# EAGLE design PoElli-at (EAGLE 6.5.0)
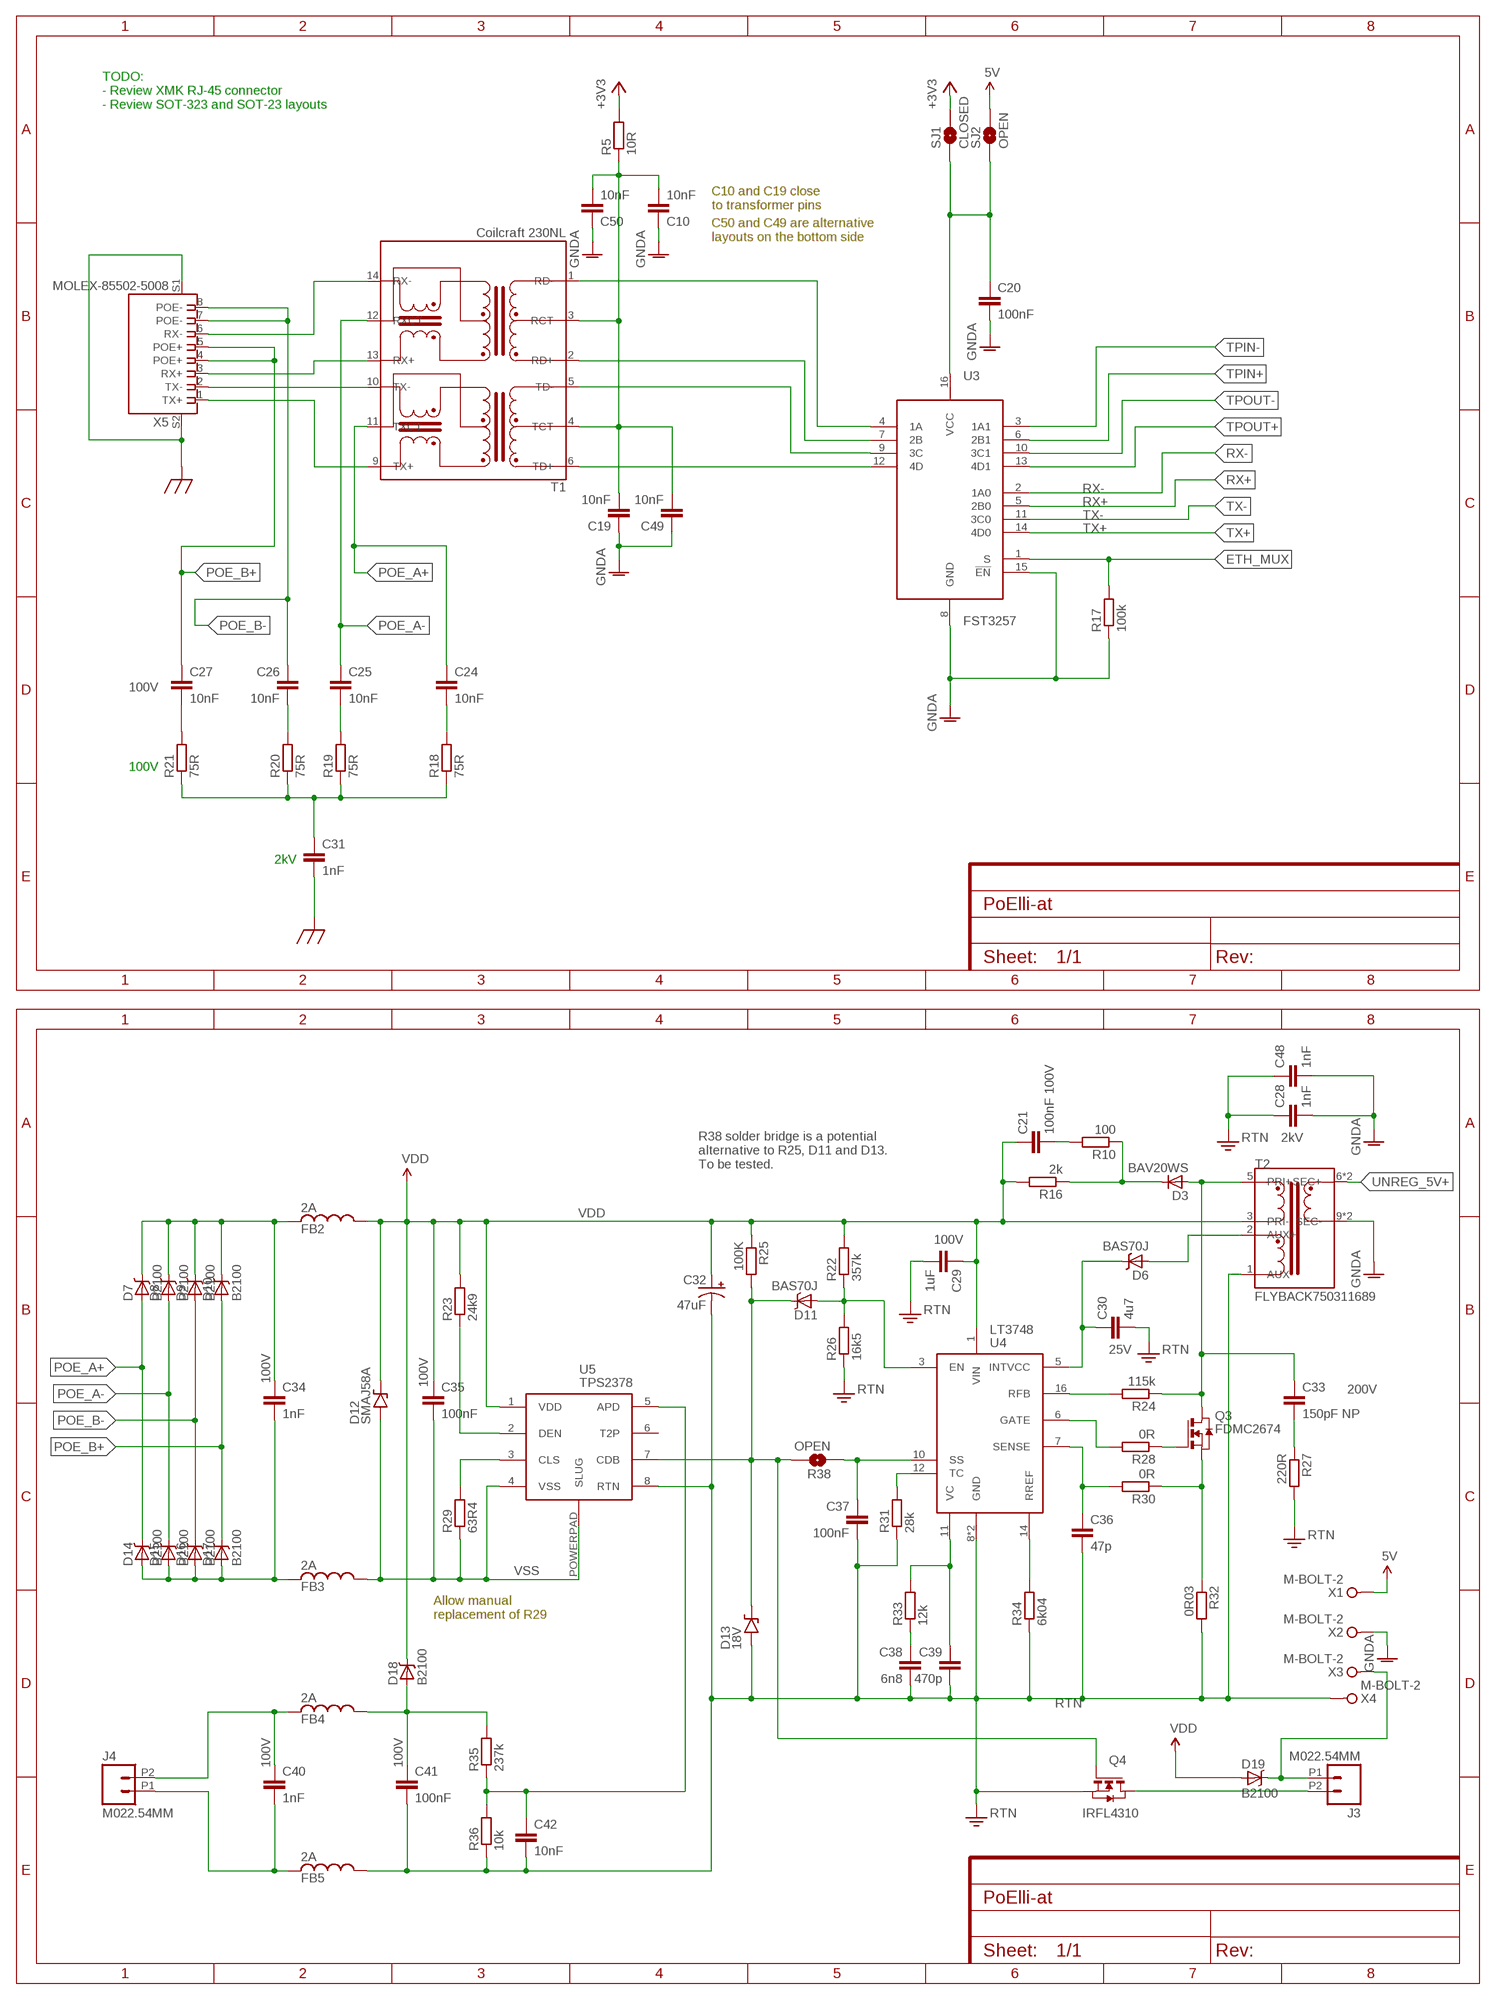
[diagram p0: schematic, sheet 1, part 1 of 2]
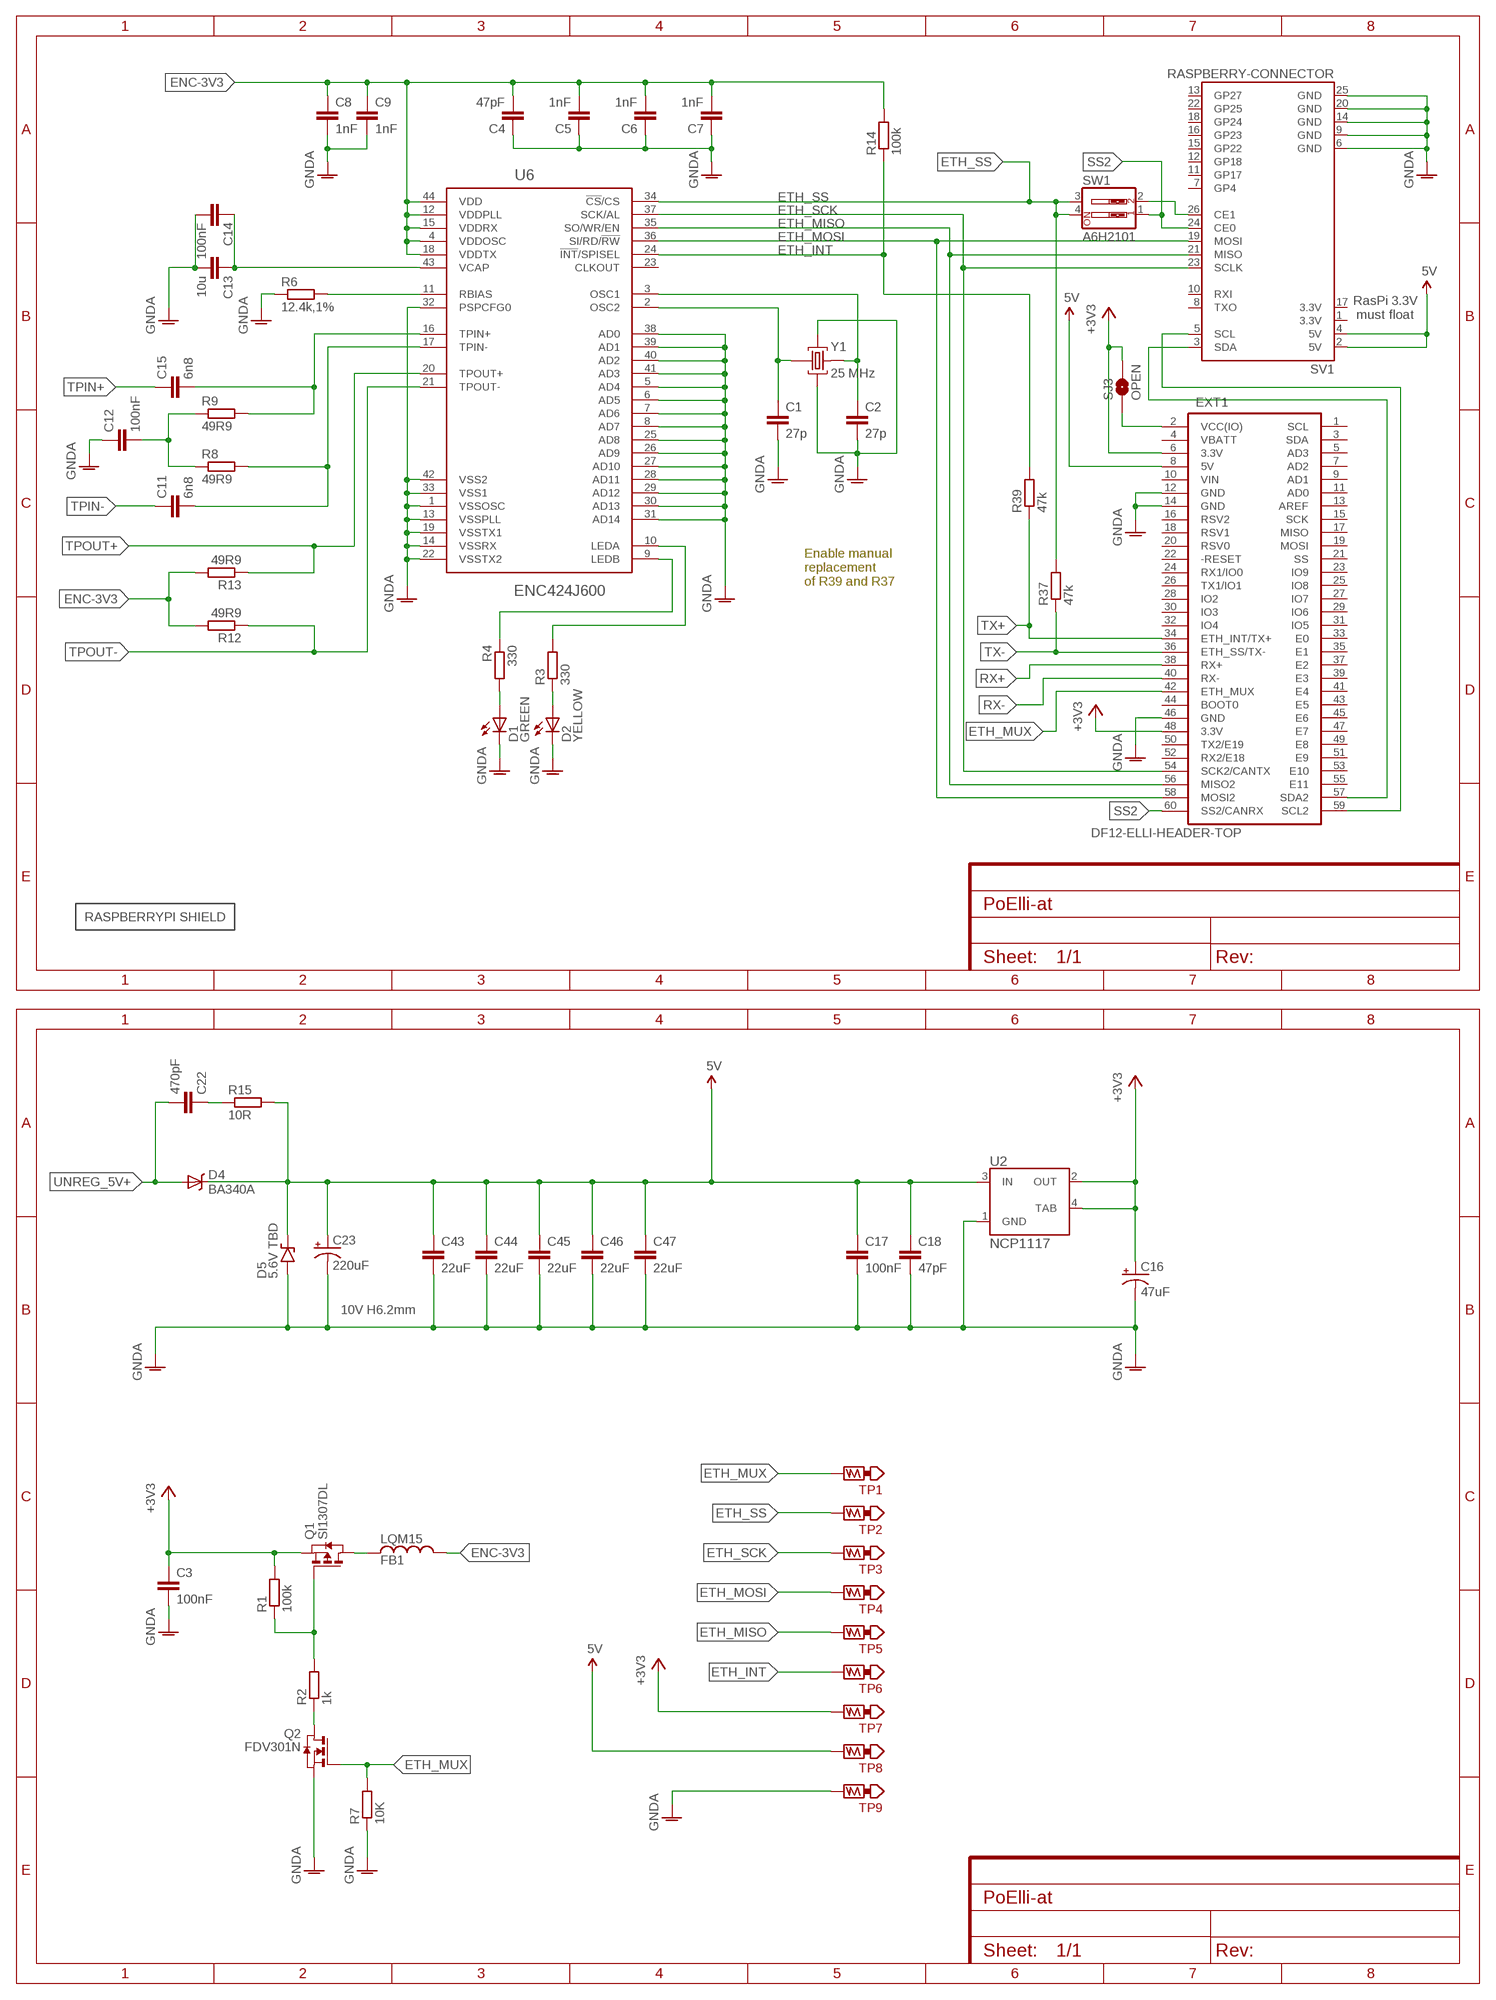
[diagram p1: schematic, sheet 1, part 2 of 2]

## Parts
C1  27p  C0402  [C0402]
C2  27p  C0402  [C0402]
C3  100nF  C0402  [C0402]
C4  47pF  C0402  [C0402]
C5  1nF  C0402  [C0402]
C6  1nF  C0402  [C0402]
C7  1nF  C0402  [C0402]
C8  1nF  C0402  [C0402]
C9  1nF  C0402  [C0402]
C10  10nF  C0402  [C0402]
C11  6n8  C0402  [C0402]
C12  100nF  C0402  [C0402]
C13  10u  C0603  [C0603]
C14  100nF  C0402  [C0402]
C15  6n8  C0402  [C0402]
C16  47uF  CPOL1206  [CT3216]
C17  100nF  C0402  [C0402]
C18  47pF  C0402  [C0402]
C19  10nF  C0402  [C0402]
C20  100nF  C0402  [C0402]
C21  100nF 100V  C0805  [C0805]
C22  470pF  C0603  [C0603]
C23  220uF  CPOLE  [CPOL_PANASONIC_E]
C24  10nF  C0603  [C0603]
C25  10nF  C0603  [C0603]
C26  10nF  C0603  [C0603]
C27  10nF  C0603  [C0603]
C28  1nF  CC1206  [C1206]
C29  1uF  C0805  [C0805]
C30  4u7  C0805  [C0805]
C31  1nF  C1210  [C1210]
C32  47uF  CPOL1206  [CT3216]
C33  150pF NP  C0805  [C0805]
C34  1nF  C0603  [C0603]
C35  100nF  C0805  [C0805]
C36  47p  C0402  [C0402]
C37  100nF  C0402  [C0402]
C38  6n8  C0402  [C0402]
C39  470p  C0402  [C0402]
C40  1nF  C0603  [C0603]
C41  100nF  C0805  [C0805]
C42  10nF  C0603  [C0603]
C43  22uF  C0805  [C0805]
C44  22uF  C0805  [C0805]
C45  22uF  C0805  [C0805]
C46  22uF  C0805  [C0805]
C47  22uF  C0805  [C0805]
C48  1nF  CC1206  [C1206]
C49  10nF  C0402  [C0402]
C50  10nF  C0402  [C0402]
D1  GREEN  LED-GREEN0603  [LED-0603]
D2  YELLOW  LED-YELLOW0603  [LED-0603]
D3  BAV20WS  [SOD-323]
D4  BA340A  B340A  [SMA-DIODE]
D5  5.6V TBD  DIODE-ZENER-SOD-123  [SOD-123FL]
D6  BAS70J  [SOD-323]
D7  B2100  DIODE-SCHOTTKYB2100  [DIODE-B2100]
D8  B2100  DIODE-SCHOTTKYB2100  [DIODE-B2100]
D9  B2100  DIODE-SCHOTTKYB2100  [DIODE-B2100]
D10  B2100  DIODE-SCHOTTKYB2100  [DIODE-B2100]
D11  BAS70J  [SOD-323]
D12  SMAJ58A  [SMA]
D13  18V  DIODE-ZENER-SOD-123  [SOD-123FL]
D14  B2100  DIODE-SCHOTTKYB2100  [DIODE-B2100]
D15  B2100  DIODE-SCHOTTKYB2100  [DIODE-B2100]
D16  B2100  DIODE-SCHOTTKYB2100  [DIODE-B2100]
D17  B2100  DIODE-SCHOTTKYB2100  [DIODE-B2100]
D18  B2100  DIODE-SCHOTTKYB2100  [DIODE-B2100]
D19  B2100  DIODE-SCHOTTKYB2100  [DIODE-B2100]
EXT1  DF12-ELLI-HEADER-TOP  [DF12(4.0)-60DP-0.5V]
FB1  LQM15  FB0402  [FB0402]
FB2  2A  FB1206  [FB1206]
FB3  2A  FB1206  [FB1206]
FB4  2A  FB1206  [FB1206]
FB5  2A  FB1206  [FB1206]
J3  M022.54MM  M022.54MM_SCREWTERM  [1X02_2.54_SCREWTERM]
J4  M022.54MM  M022.54MM_SCREWTERM  [1X02_2.54_SCREWTERM]
OUTLINE1  RASPBERRY-OUTLINE  [RASPBERRYPI-SHIELD-OUTLINE]
Q1  SI1307DL  [SOT-323]
Q2  FDV301N  [SOT-23]
Q3  FDMC2674  [MLP8L33]
Q4  IRFL4310  [SOT223]
R1  100k  R0402  [R0402]
R2  1k  R0402  [R0402]
R3  330  R0402  [R0402]
R4  330  R0402  [R0402]
R5  10R  R0603  [R0603]
R6  12.4k,1%  R0402  [R0402]
R7  10K  R0402  [R0402]
R8  49R9  R0402  [R0402]
R9  49R9  R0402  [R0402]
R10  100  R0603  [R0603]
R12  49R9  R0402  [R0402]
R13  49R9  R0402  [R0402]
R14  100k  R0402  [R0402]
R15  10R  R0603  [R0603]
R16  2k  R1206  [R1206]
R17  100k  R0402  [R0402]
R18  75R  R0603  [R0603]
R19  75R  R0603  [R0603]
R20  75R  R0603  [R0603]
R21  75R  R0603  [R0603]
R22  357k  R0603  [R0603]
R23  24k9  R0603  [R0603]
R24  115k  R0603  [R0603]
R25  100K  R0603  [R0603]
R26  16k5  R0603  [R0603]
R27  220R  R0805  [R0805]
R28  0R  R0603  [R0603]
R29  63R4  R0805  [R0805]
R30  0R  R0603  [R0603]
R31  28k  R0603  [R0603]
R32  0R03  R0805  [R0805]
R33  12k  R0603  [R0603]
R34  6k04  R0603  [R0603]
R35  237k  R0603  [R0603]
R36  10k  R0603  [R0603]
R37  47k  R0805  [R0805]
R38  OPEN  SOLDERJUMPERNO  [SJ_2S-NO]
R39  47k  R0805  [R0805]
SJ1  CLOSED  SOLDERJUMPERNC  [SJ_2S]
SJ2  OPEN  SOLDERJUMPERNO  [SJ_2S-NO]
SJ3  OPEN  SOLDERJUMPERNO  [SJ_2S-NO]
SV1  RASPBERRY-CONNECTOR  [RASPBERRYPI-SHIELD-CONNECTOR]
SW1  A6H2101  SW_DIP-2-SMT-HALFSIZE  [DIPSWITCH-02-50MIL]
T1  Coilcraft 230NL  POE-ISOLATION-230NL  [COILCRAFT-ETH1-230L]
T2  FLYBACK750311689  [WE_EP13_SMD_10PIN]
TP1  TEST_POINT-5000  [TP_5021]
TP2  TEST_POINT-5021  [TP_5000]
TP3  TEST_POINT-5021  [TP_5000]
TP4  TEST_POINT-5021  [TP_5000]
TP5  TEST_POINT-5000  [TP_5021]
TP6  TEST_POINT-5000  [TP_5021]
TP7  TEST_POINT-5000  [TP_5021]
TP8  TEST_POINT-5000  [TP_5021]
TP9  TEST_POINT-5000  [TP_5021]
U2  NCP1117  [SOT223]
U3  FST3257  [SOIC-16-NARROW]
U4  LT3748  [MSOP16(12)]
U5  TPS2378  [SO08-POWERPAD]
U6  ENC424J600  [TQFP44-0.8MM]
X1  M-BOLT-2  [M2-1]
X2  M-BOLT-2  [M2-1]
X3  M-BOLT-2  [M2-1]
X4  M-BOLT-2  [M2-1]
X5  MOLEX-85502-5008  POE-TP-SHIELDED-RJ45-MOLEX-85502-5008  [MOLEX-85502-5008]
Y1  25 MHz  CRYSTAL_WITH_GND  [CRYSTAL-SMD-3225-GND]

## Nets
5V [High current 3A (low voltage)]: C17.1 C18.1 C23.+ C43.1 C44.1 C45.1 C46.1 C47.1 D4.C D5.C EXT1.8(5V) R15.2 SJ2.2 SV1.2(5V) SV1.4(5V) TP8.P$1 U2.3(IN) X1.1(KL1)
+3V3 [High current 3A (low voltage)]: C3.1 C16.A(+) EXT1.6(3.3V) EXT1.48(3.3V) Q1.P$2(S) R1.2 R5.2 SJ1.2 SJ3.2 TP7.P$1 U2.2(OUT) U2.4(TAB)
ENC-3V3: C4.2 C5.2 C6.2 C7.2 C8.1 C9.1 FB1.2 R12.2 R13.2 R14.2 U6.4(VDDOSC) U6.12(VDDPLL) U6.15(VDDRX) U6.18(VDDTX) U6.44(VDD)
ETH_INT: R14.1 R39.2 TP6.P$1 U6.24(!INT!/SPISEL)
ETH_MISO: EXT1.56(MISO2) SV1.21(MISO) TP5.P$1 U6.35(SO/WR/EN)
ETH_MOSI: EXT1.58(MOSI2) SV1.19(MOSI) TP4.P$1 U6.36(SI/RD/!RW)
ETH_MUX: EXT1.42(ETH_MUX) Q2.P$1(G) R7.2 R17.2 TP1.P$1 U3.1(S)
ETH_SCK: EXT1.54(SCK2/CANTX) SV1.23(SCLK) TP3.P$1 U6.37(SCK/AL)
ETH_SS: R37.2 SW1.3 SW1.4 TP2.P$1 U6.34(!CS!/CS)
GNDA [High current 3A (low voltage)]: C1.2 C2.2 C3.2 C4.1 C5.1 C6.1 C7.1 C8.2 C9.2 C10.1 C12.1 C13.2 C14.2 C16.C(-) C17.2 C18.2 C19.1 C20.2 C23.- C28.2 C43.2 C44.2 C45.2 C46.2 C47.2 C48.2 C49.1 C50.1 D1.C D2.C D5.A EXT1.12(GND) EXT1.14(GND) EXT1.46(GND) Q2.P$2(S) R6.1 R7.1 R17.1 SV1.6(GND) SV1.9(GND) SV1.14(GND) SV1.20(GND) SV1.25(GND) T2.9(SEC-) T2.10(SEC-) TP9.P$1 U2.1(GND) U3.8(GND) U3.15(!EN) U6.1(VSSOSC) U6.5(AD4) U6.6(AD5) U6.7(AD6) U6.8(AD7) U6.13(VSSPLL) U6.14(VSSRX) U6.19(VSSTX1) U6.22(VSSTX2) U6.25(AD8) U6.26(AD9) U6.27(AD10) U6.28(AD11) U6.29(AD12) U6.30(AD13) U6.31(AD14) U6.32(PSPCFG0) U6.33(VSS1) U6.38(AD0) U6.39(AD1) U6.40(AD2) U6.41(AD3) U6.42(VSS2) X2.1(KL1) Y1.2(GND) Y1.4(GND)
N$1 [PoE 48V 1A]: T1.10(TX-) X5.2(TX-)
N$2 [PoE 48V 1A]: T1.9(TX+) X5.1(TX+)
N$3 [PoE 48V 1A]: T1.13(RX+) X5.3(RX+)
N$4 [PoE 48V 1A]: T1.14(RX-) X5.6(RX-)
N$5: C31.1 R18.1 R19.1 R20.1 R21.1
N$6 [PoE 48V 1A]: C34.1 D7.C D8.C D9.C D10.C FB2.1
N$7: R31.2 U4.12(TC)
N$8 [PoE 48V 1A]: C34.2 D14.A D15.A D16.A D17.A FB3.1
N$9: D11.2(C) D13.C Q4.1(G) R25.2 R38.2 U5.7(CDB)
N$10 [PoE 48V 1A]: J3.P2 Q4.2(D) Q4.4(D)
N$11: T1.6(TD+) U3.12(4D)
N$12: T1.5(TD-) U3.9(3C)
N$13: T1.2(RD+) U3.7(2B)
N$14: T1.1(RD-) U3.4(1A)
N$15: C33.2 R27.1
N$16: C22.1 R15.1
N$17: D11.1(A) R22.1 R26.2 U4.3(EN)
N$18: R23.1 U5.2(DEN)
N$19: R29.2 U5.3(CLS)
N$20: C37.1 R38.1 U4.10(SS)
N$21 [PoE 48V 1A]: D19.C J3.P1 X3.1(KL1)
N$22: C39.1 R33.2 U4.11(VC)
N$23: C38.1 R33.1
N$24: R28.2 U4.6(GATE)
N$25: Q3.4(G) R28.1
N$26: C36.1 R30.2 U4.7(SENSE)
N$27 [PoE 48V 1A]: Q3.1(S) Q3.2(S) Q3.3(S) R30.1 R32.1
N$28 [High voltage 200V and current 1A]: C33.1 D3.1(A) Q3.5(D) Q3.6(D) Q3.7(D) Q3.8(D) Q3.F1(D) R24.1 T2.5(PRI+)
N$29: D6.1(A) T2.2(AUX+)
N$31: R24.2 U4.16(RFB)
N$32: R34.2 U4.14(RREF)
N$33: D3.2(C) R10.1 R16.1
N$34: C21.2 R10.2
N$36: D1.A R4.2
N$37: C1.1 U6.2(OSC2) Y1.1(C1)
N$38: D2.A R3.1
N$39: C11.2 R8.2 U6.17(TPIN-)
N$40: C10.2 C19.2 C49.2 C50.2 R5.1 T1.3(RCT) T1.4(TCT)
N$41: R4.1 U6.9(LEDB)
N$42: R3.2 U6.10(LEDA)
N$44: C12.2 R8.1 R9.1
N$45: R6.2 U6.11(RBIAS)
N$47: C2.1 U6.3(OSC1) Y1.3(C2)
N$48: C27.2 R21.2
N$50: C24.2 R18.2
N$51: C25.2 R19.2
N$52: C26.2 R20.2
N$53 [PoE 48V 1A]: C40.1 FB4.1 J4.P2
N$54: C42.1 R35.1 R36.2 U5.5(APD)
N$55 [PoE 48V 1A]: C40.2 FB5.1 J4.P1
N$56: Q2.P$3(D) R2.1
N$57: Q1.P$1(G) R1.1 R2.2
N$59: C15.2 R9.2 U6.16(TPIN+)
N$60: FB1.1 Q1.P$3(D)
N$72: EXT1.57(SDA2) SV1.3(SDA)
N$73: EXT1.59(SCL2) SV1.5(SCL)
N$74: SV1.26(CE1) SW1.2
N$76: C41.1 D18.A FB4.2 R35.2
POE_A+ [PoE 48V 1A]: C24.1 D7.A D14.C T1.11(TXCT)
POE_A- [PoE 48V 1A]: C25.1 D8.A D15.C T1.12(RXCT)
POE_B+ [PoE 48V 1A]: C27.1 D10.A D17.C X5.4(POE+) X5.5(POE+)
POE_B- [PoE 48V 1A]: C26.1 D9.A D16.C X5.7(POE-) X5.8(POE-)
RTN [PoE 48V 1A]: C28.1 C29.2 C30.2 C32.C(-) C36.2 C37.2 C38.2 C39.2 C41.2 C42.2 C48.1 D13.A FB5.2 Q4.3(S) R26.1 R27.2 R31.1 R32.2 R34.1 R36.1 T2.1(AUX-) U4.8(GND) U4.9(GND) U5.8(RTN) X4.1(KL1)
RX+: EXT1.38(RX+) U3.5(2B0)
RX-: EXT1.40(RX-) U3.2(1A0)
SGND: C31.2 X5.S1(GND) X5.S2(GND)
SS2: EXT1.60(SS2/CANRX) SV1.24(CE0) SW1.1
TPIN+: C15.1 U3.6(2B1)
TPIN-: C11.1 U3.3(1A1)
TPOUT+: R13.1 U3.13(4D1) U6.20(TPOUT+)
TPOUT-: R12.1 U3.10(3C1) U6.21(TPOUT-)
TX+: EXT1.34(ETH_INT/TX+) R39.1 U3.14(4D0)
TX-: EXT1.36(ETH_SS/TX-) R37.1 U3.11(3C0)
U3_VCC: C20.1 SJ1.1 SJ2.1 U3.16(VCC)
U4_INTVCC: C30.1 D6.2(C) U4.5(INTVCC)
UNREG_5V+ [High current 3A (low voltage)]: C22.2 D4.A T2.6(SEC+) T2.7(SEC+)
VCAP: C13.1 C14.1 U6.43(VCAP)
VCC(IO): EXT1.2(VCC(IO)) SJ3.1
VDD [PoE 48V 1A]: C21.1 C29.1 C32.A(+) C35.1 D12.1(C) D18.C D19.A FB2.2 R16.2 R22.2 R23.2 R25.1 T2.3(PRI-) U4.1(VIN) U5.1(VDD)
VSS [PoE 48V 1A]: C35.2 D12.2(A) FB3.2 R29.1 U5.4(VSS) U5.POWERPAD(SLUG)
Unconnected: EXT1.1(SCL) EXT1.3(SDA) EXT1.5(AD3) EXT1.7(AD2) EXT1.9(AD1) EXT1.11(AD0) EXT1.13(AREF) EXT1.15(SCK) EXT1.16(RSV2) EXT1.17(MISO) EXT1.18(RSV1) EXT1.19(MOSI) EXT1.20(RSV0) EXT1.21(SS) EXT1.22(-RESET) EXT1.23(IO9) EXT1.24(RX1/IO0) EXT1.25(IO8) EXT1.26(TX1/IO1) EXT1.27(IO7) EXT1.28(IO2) EXT1.29(IO6) EXT1.30(IO3) EXT1.31(IO5) EXT1.32(IO4) EXT1.33(E0) EXT1.35(E1) EXT1.37(E2) EXT1.39(E3) EXT1.41(E4) EXT1.43(E5) EXT1.44(BOOT0) EXT1.45(E6) EXT1.47(E7) EXT1.49(E8) EXT1.50(TX2/E19) EXT1.51(E9) EXT1.52(RX2/E18) EXT1.53(E10) EXT1.55(E11) SV1.7(GP4) SV1.8(TXO) SV1.10(RXI) SV1.11(GP17) SV1.12(GP18) SV1.13(GP27) SV1.15(GP22) SV1.16(GP23) SV1.18(GP24) SV1.22(GP25) U5.6(T2P) U6.23(CLKOUT)

## Notes on the sheet
- TODO:
  - Review XMK RJ-45 connector
  - Review SOT-323 and SOT-23 layouts
- C10 and C19 close 
  to transformer pins
- C50 and C49 are alternative
  layouts on the bottom side
- RasPi 3.3V 
  must float
- Enable manual 
  replacement
  of R39 and R37
- 100V
- 100V
- 2kV
- 2kV
- R38 solder bridge is a potential
  alternative to R25, D11 and D13.
  To be tested.
- 100V
- 10V H6.2mm
- 25V
- 100V
- 100V
- 200V
- Allow manual 
  replacement of R29
- 100V | 100V

## Power pins joined to a net without a drawn wire
3.3V: SV1.1(3.3V) SV1.17(3.3V)
VBATT: EXT1.4(VBATT)
VIN: EXT1.10(VIN)

## Library data of the parts
C1-C15 C17-C22 C24-C31 C33-C50 = ELL-i-Passives:C: Surface Mount Capasitors — in standard sizes A capacitor used to store energy electrostatically in an electric field. If you need a high-value capacitor, consider using a polarised capacitor to save space. Wikipedia article on capacitors <https://en.wikipedia.org/wiki/Capacitor>
C16 C23 C32 = ELL-i-Passives:CPOL: Polarized Capacitor — common SMD and some through-hole ones A capacitor used to store energy electrostatically in an electric field. If you need a high-value capacitor, consider using a polarised capacitor to save space. Wikipedia article on capacitors <https://en.wikipedia.org/wiki/Capacitor> These are standard surface mount (SMD) and through-hole (PTH) capacitors. Normally 10uF, 47uF, and 100uF in electrolytic and tantalum varieties. Always verify the external diameter of the through hole cap, it varies with capacity, voltage, and manufacturer. The EIA tantalum devices should have standard packages. Copied from SparkFun-Passives.lbr under SparkFun Creative Commons license. Adopted to EagleUp usage through renaming the packages appropriately.
D1 = SparkFun-LED:LED-GREEN: Various green LEDs Green LEDs used in SFE Production 0603- DIO-00821 LARGE- DIO-00862 LILYPAD- DIO-09910; PROD_ID: DIO-00821
D2 = SparkFun-LED:LED-YELLOW: Yellow SMD LEDs LilyPad 1206- DIO-09909 0603- DIO-09003; PROD_ID: DIO-09003
D3 = ELL-i-DIscreteSemi:BAV20WS: Small Signal Switching Diodes, High Voltage Diodes datasheet <http://www.diodes.com/datasheets/ds30119.pdf> Vishay datasheet <http://www.vishay.com/docs/85726/bav19ws.pdf>
D4 = SparkFun-DiscreteSemi:B340A: Schottky Diode 3A-40V; PROD_ID: DIO-09886
D5 D13 = ELL-i-DIscreteSemi:DIODE-ZENER
D6 D11 = ELL-i-DIscreteSemi:BAS70: Silicon Schottky Diodes General-purpose diode for high-speed switching. Maximum forward current 70 mA Maxiumum forward voltage drop Vf 0.410 mV Maximum reverse voltage 70V
D7-D10 D14-D19 = ELL-i-DIscreteSemi:DIODE-SCHOTTKY: Schottky Diodes A Schottky diode has a low forward voltage drop and a very fast switching action. A normal silicon diode has a voltage drop between 0.6–0.7 volts, while a Schottky diode voltage drop is between approximately 0.15–0.45 volts. This lower voltage drop can provide higher switching speed and better system efficiency. Wikipedia article on Schottky diodes <https://en.wikipedia.org/wiki/Schottky_diode>
D12 = ELL-i-DIscreteSemi:SMAJ58A
EXT1 = ELL-i-Connectors:DF12-ELLI-*
FB1-FB5 = ELL-i-Passives:FB: Ferrite beads Ferrite beads are choke coils used to suppress high frequency noise in electronic circuits. Wikipedia article on ferrite beads <https://en.wikipedia.org/wiki/Ferrite_bead>
J3 J4 = SparkFun-Connectors:M02: Standard 2-pin 0.1" header. Use with - straight break away headers ( PRT-00116) - right angle break away headers (PRT-00553) - swiss pins (PRT-00743) - machine pins (PRT-00117) - female headers (PRT-00115) Molex polarized connector foot print use with: PRT-08233 with associated crimp pins and housings. 2.54_SCREWTERM for use with PRT-10571. 3.5mm Screw Terminal footprints for PRT-08084 5mm Screw Terminal footprints for use with PRT-08433
OUTLINE1 = ELL-i-Boards:RASPBERRY-OUTLINE
Q1 = ELL-i-DIscreteSemi:SI1307DL
Q2 = ELL-i-DIscreteSemi:FDV301N: Digital FET, N-Channel This device has been designed especially for low voltage applications as a replacement for digital transistors. 25 V, 0.22 A continuous. 0.5 A peak Rds(on) < 5R @ Vgs 2.7 V. Datasheet <http://datasheet.octopart.com/FDV301N-Fairchild-datasheet-8330556.pdf>
Q3 = ELL-i-DIscreteSemi:FDMC2674: 220V N-Channel UltraFET Trench MOSFET This is a power MOSFET, capable of passing 2A of current and lasting some 200V, in a small MLP package. For a typical flyback converter, you need the switching FET to last much higher voltage than the nominal primary side voltage, as the flyback generates a high parasitic voltage at the time the FET switches off, before the so-called snubber circuit is able to absorb it. Datasheet <http://www.fairchildsemi.com/ds/FD/FDMC2674.pdf‎>
Q4 = ELL-i-DIscreteSemi:IRFL4310
R1-R10 R12-R37 R39 = ELL-i-Passives:R: Surface Mount Resistor — in standard sizes
R38 SJ1-SJ3 = SparkFun-Passives:SOLDERJUMPER: Solder Jumper Standard SMD solder jumper. Used to automate production. Two varients : Normally Open and Normally Closed are the same, but have different paste layers. NC will have a large amount of paste and should jumper during reflow.
SV1 = ELL-i-Boards:RASPBERRY-CONNECTOR
SW1 = SparkFun-Electromechanical:SW_DIP-2: DIP SWITCH
T1 = ELL-i-Transformers:POE-ISOLATION: Power-over-Ethernet isolation transformers In twisted pair Ethernet networks, there is a 1500V isolation transformer between the network cable and the connected device. In Power-over-Ethernet devices, the transformer provides the extra function of allowing the DC power to be extracted from the cable-side center taps of the transformer. For high-power PoE, the transformer cable-side winding must be of thick enough wire (i.e. have low-enough resistance) to carry the DC current without warming up too much. Isolation transformers <https://en.wikipedia.org/wiki/Isolation_transformer> (general article) Power-over-Ethernet <https://en.wikipedia.org/wiki/Power_over_Ethernet> (general article)
T2 = ELL-i-Transformers:FLYBACK: Flyback SMPS transformer These types of transformers are often used in flyback and forward SMPS converters. The primary-side auxillary winding typically used to generate a 7-12 V auxillary voltage, which is used to generate the operating voltage (VCC) for the SMPS controller chip. The packages includes the ones used at various ELL-i boards.
TP1-TP9 = ELL-i-Passives:TEST_POINT: Used for easier attachment of measuring equipment. Has both test loops and bare copper area.
U2 = ELL-i-PowerIC:NCP1117
U3 = ELL-i-DigitalIC:FST3257: Quad 2:1 Multiplexer / Demultiplexer Bus Switch
U4 = ELL-i-PowerIC:LT3748: 100V Isolated Flyback Controller A switching regulator controller designed for the isolated flyback topology. Drives an external N-channel power MOSFET from an internally regulated 7V supply. No third winding or opto-isolator are required. Product page <http://www.linear.com/product/LT3748> Datasheet <http://www.linear.com/docs/29653> Wiki page <https://github.com/Ell-i/ELL-i-Eagle-Libraries/wiki/PowerIC-LT3748>
U5 = ELL-i-PowerIC:TPS2378: TI 802.3at Power-over-Ethernet controller with an integrated FET This IC contains all of the features needed to implement an IEEE802.3at type-2 powered device (PD). It includes an 0.5 Ω RDSON Power FET, which enables continuous 0.85 A current. It supports also auxiliary power. Product page <http://www.ti.com/product/tps2378> Datasheet <http://www.ti.com/lit/gpn/tps2378> Wiki page <https://github.com/Ell-i/ELL-i-Eagle-Libraries/wiki/PowerIC-TPS2378>
U6 = ELL-i-DigitalIC:ENC424J600: ENC424J600 The ENC424J600 and ENC624J600 are stand-alone, Fast Ethernet controllers with an industry standard Serial Peripheral Interface (SPI) or a flexible parallel interface. They are designed to serve as an Ethernet network interface for any microcontroller equipped with SPI or a standard parallel port Not reviewed. Datasheet <http://ww1.microchip.com/downloads/en/DeviceDoc/39935b.pdf>
X1-X4 = ELL-i-Connectors:M-BOLT: Metric bolt connector
X5 = ELL-i-Connectors:POE-TP-SHIELDED: Twisted pair Power-over-Ethernet MDI connector, with protective ground 8-wire Ethernet jack, with a protective ground. See the POE-TP device for more information.
Y1 = SparkFun-FreqCtrl:CRYSTAL_WITH_GND: Crystals with ground connection to case. A ground connection is used for mechanical stability and to minimize noise. Be careful to not overheat the body of crystal while soldering.

## Net classes
1 PoE 48V 1A: width 0.4 mm
2 High current 3A (low voltage): width 0.8 mm
3 High voltage 200V and current 1A: width 0.8 mm, clearance 0.5 mm

## Board
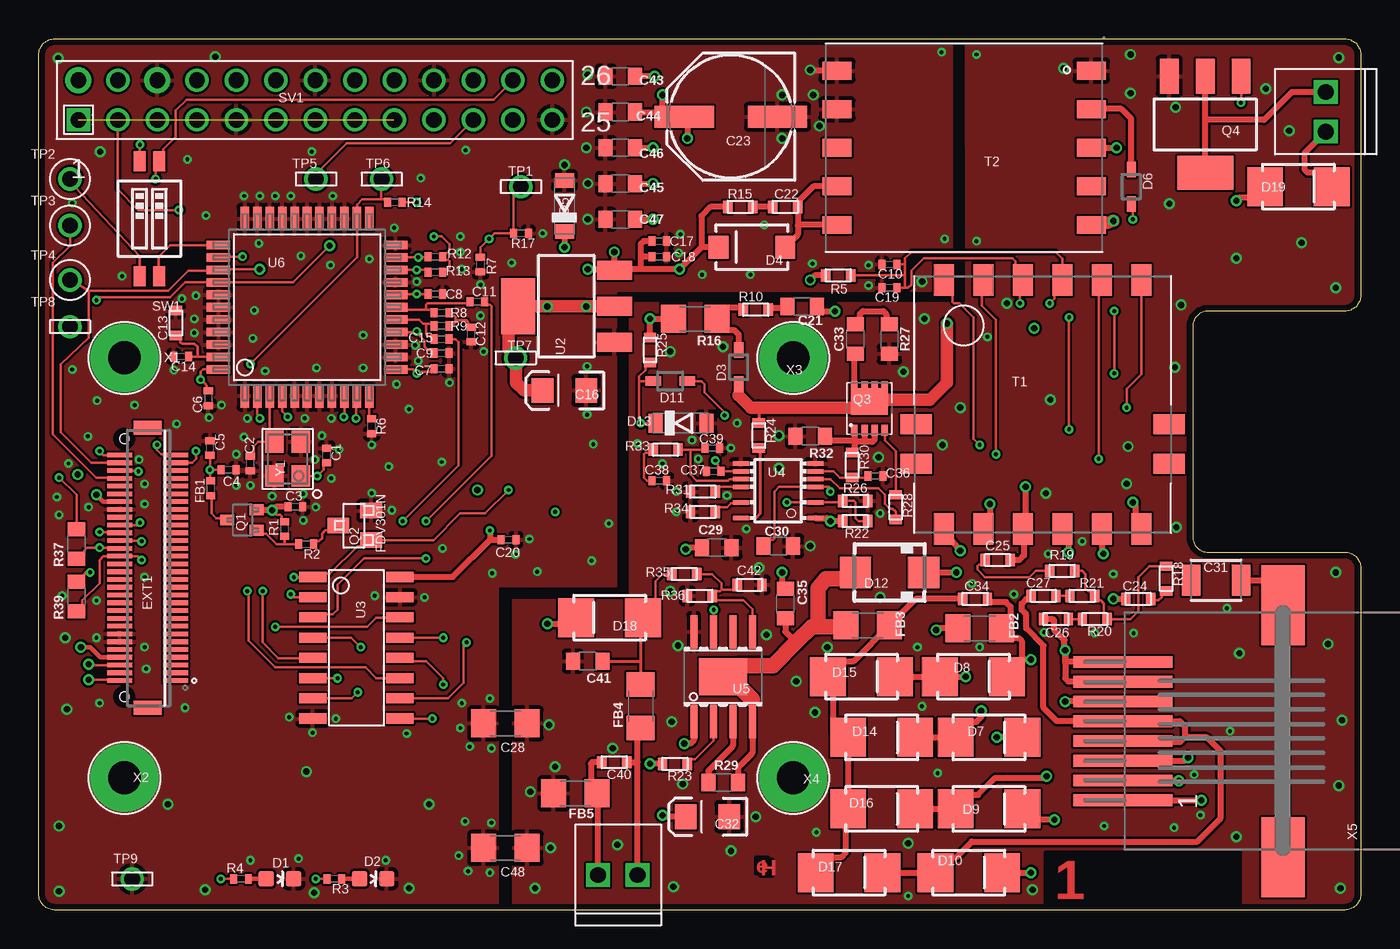
[diagram p2: board, top side]
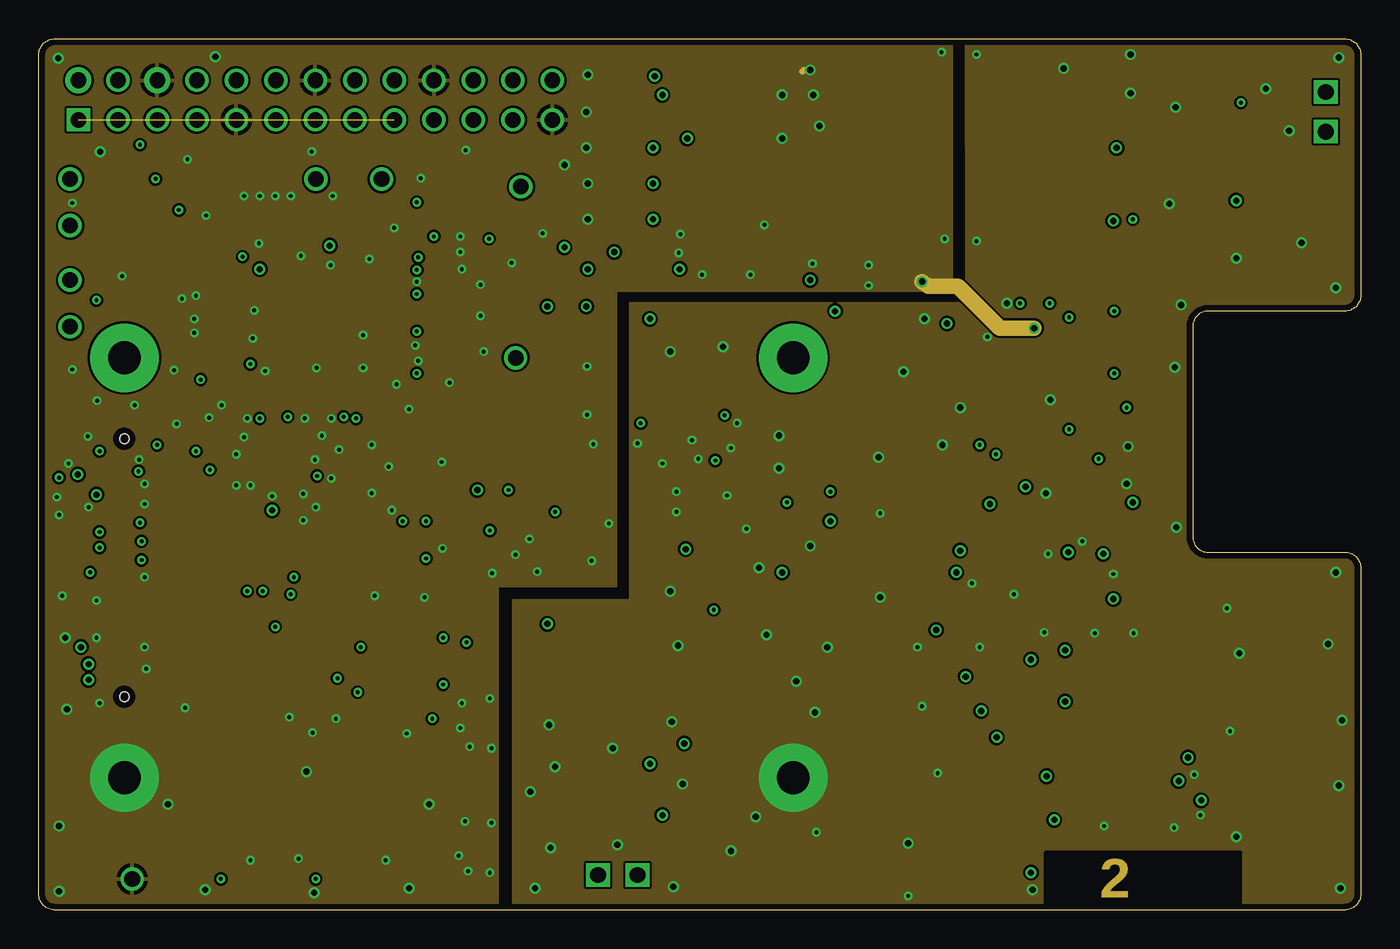
[diagram p3: board, inner layer Route2]
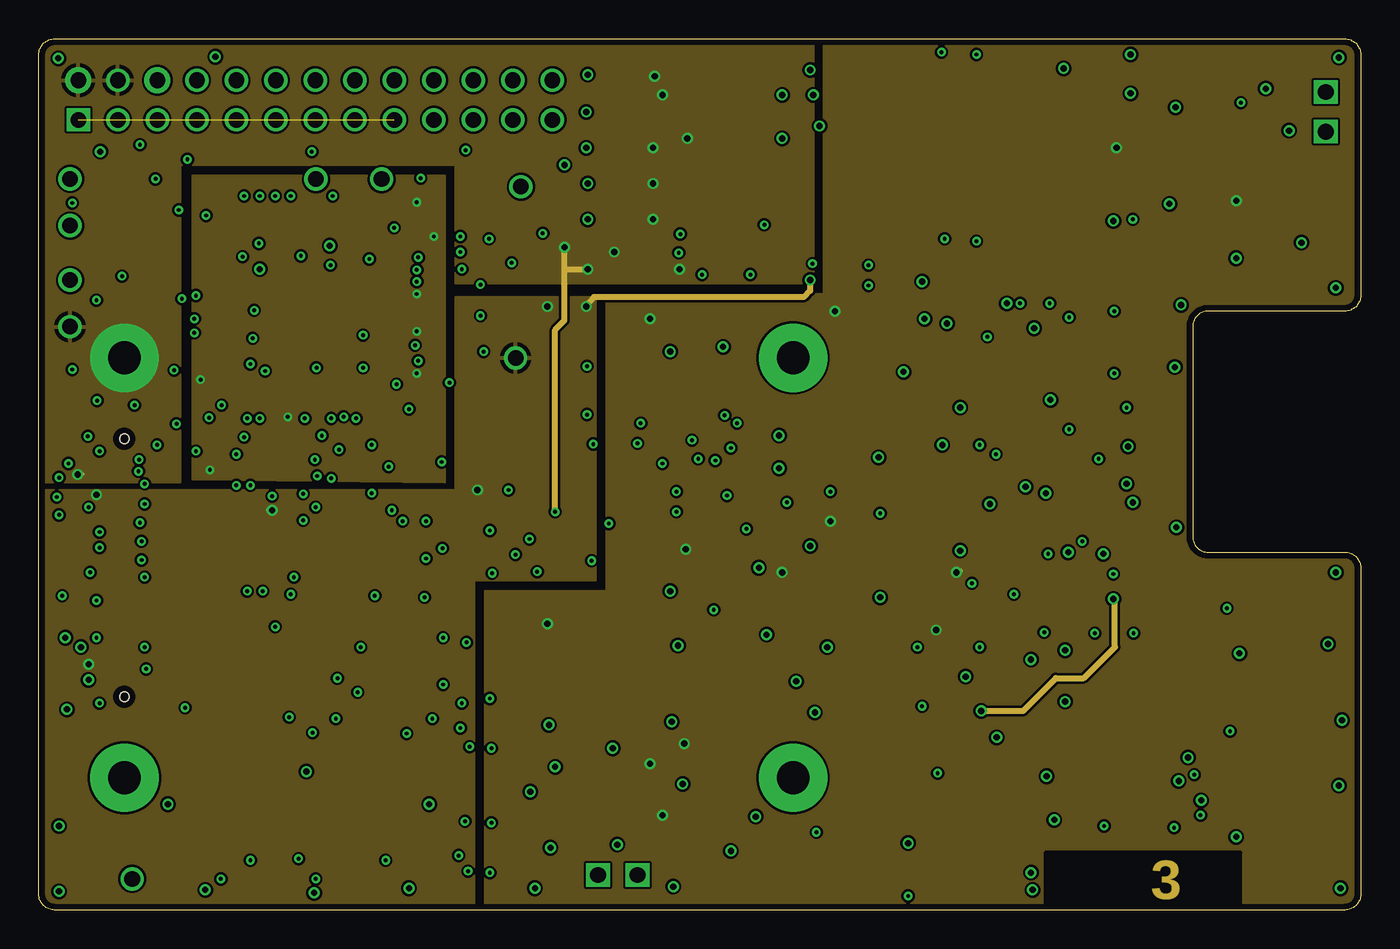
[diagram p4: board, inner layer Route15]
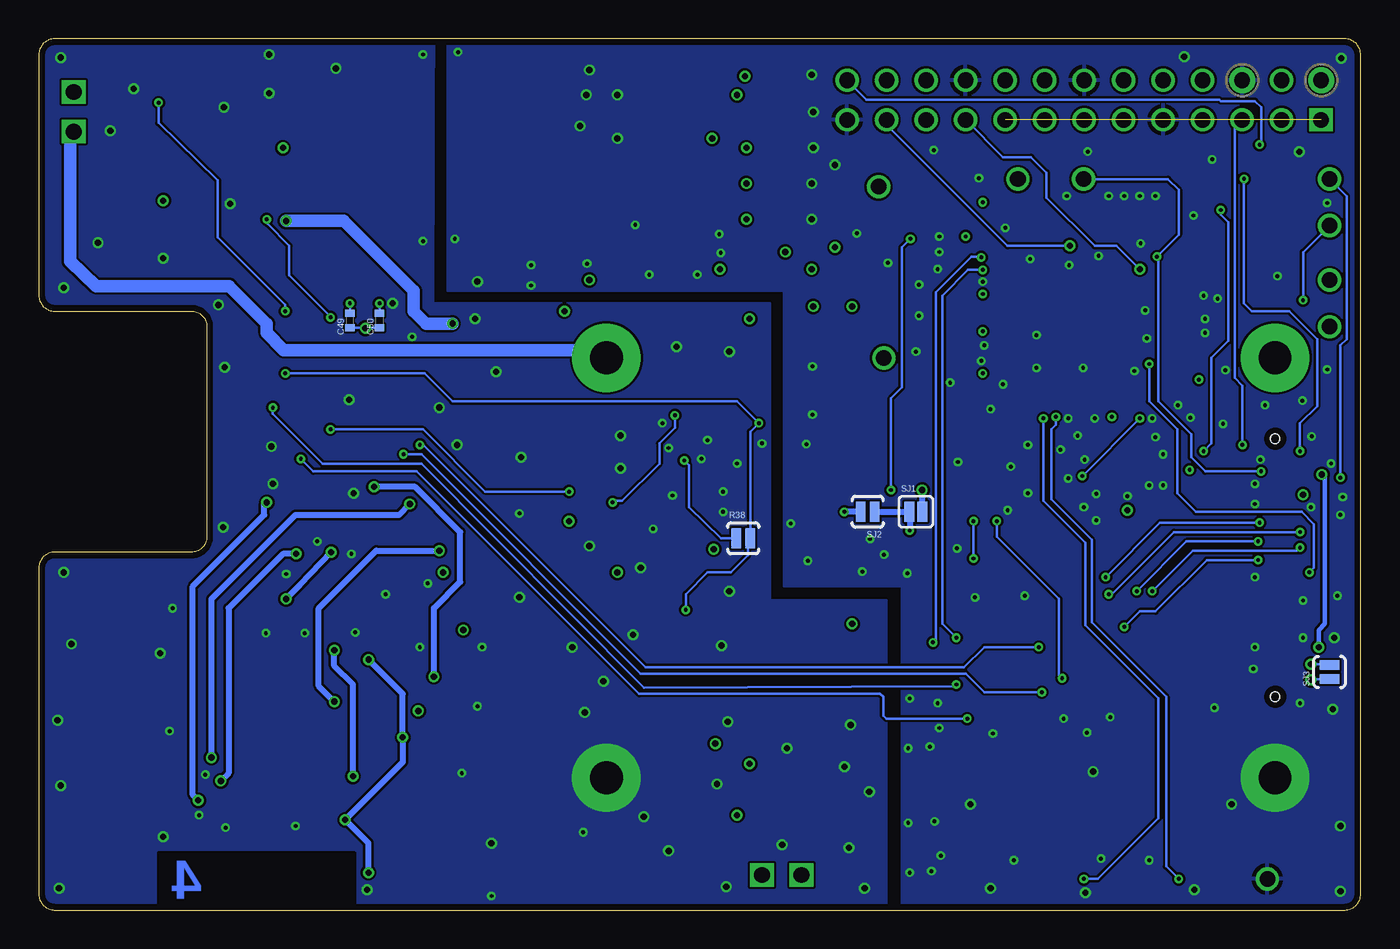
[diagram p5: board, bottom side, seen from below]

Size 85 x 56 mm. Coordinates in mm from the lower left corner, seen from the top.
Outline: 84,0 1,0 arc-90 0,1 0,55 arc-90 1,56 84,56 arc-90 85,55 85,39.5 arc-90 84,38.5 75.2,38.5 arc90 74.2,37.5 74.2,24 arc90 75.2,23 84,23 arc-90 85,22 85,1 arc-90 84,0
Copper layers (1*2+15*16): Top 0.035mm / dielectric 1.5mm / Route2 0.035mm / dielectric 0.15mm / Route15 0.035mm / dielectric 0.2mm / Bottom 0.035mm
Design rules "default *": minimum track width 0.15mm, minimum drill 0.25mm, track to track 0.15mm, track to pad 0.15mm, pad to pad 0.15mm, via to via 0.15mm, smd to smd 0mil, copper to edge 16mil, drill to drill 8mil, minimum pad ring 0.15mm, minimum via ring 0.15mm, stop-mask expansion 4mil, vias tented up to drill 0.0104125mm, thermal gap 10mil

### Footprints (pad centres in the part's own frame; a part is rotated, then mirrored left to right if it is on the bottom)
C0402 = smd 0.45 x 0.6: 1 -0.475,0; 2 0.475,0
C0603 = smd 0.6 x 0.8: 1 -0.8,0; 2 0.8,0
CT3216 = smd 1.4 x 1.6: A 1.4,0; C -1.4,0
C0805 = smd 0.9 x 1.1: 1 -0.95,0; 2 0.95,0
CPOL_PANASONIC_E = smd 3.8 x 1.4: + 3,0; - -3,0
C1206 = smd 1.6 x 1.8: 1 -1.4,0; 2 1.4,0
C1210 = smd 1.2 x 2: 1 -1.6,0; 2 1.6,0
LED-0603 = smd 1 x 1: A 0,-0.877; C 0,0.877
SOD-323 = smd 1 x 0.6: 1 -1.1,0; 2 1.1,0
SMA-DIODE = smd 1.27 x 1.47: A -2.15,0; C 2.15,0
SOD-123FL = smd 0.914 x 1.219: A 1.638,0; C -1.638,0
DIODE-B2100 = smd 2.3 x 2.5: A -2.15,0; C 2.15,0
SMA = smd 2 x 2: 1 -2.2,0; 2 2.2,0
DF12(4.0)-60DP-0.5V = smd 0.3 x 1.6: 1 -7.25,-1.8; 2 -7.25,1.8; 3 -6.75,-1.8; 4 -6.75,1.8; 5 -6.25,-1.8; 6 -6.25,1.8; 7 -5.75,-1.8; 8 -5.75,1.8; 9 -5.25,-1.8; 10 -5.25,1.8; 11 -4.75,-1.8; 12 -4.75,1.8; 13 -4.25,-1.8; 14 -4.25,1.8; 15 -3.75,-1.8; 16 -3.75,1.8; 17 -3.25,-1.8; 18 -3.25,1.8; 19 -2.75,-1.8; 20 -2.75,1.8; 21 -2.25,-1.8; 22 -2.25,1.8; 23 -1.75,-1.8; 24 -1.75,1.8; 25 -1.25,-1.8; 26 -1.25,1.8; 27 -0.75,-1.8; 28 -0.75,1.8; 29 -0.25,-1.8; 30 -0.25,1.8; 31 0.25,-1.8; 32 0.25,1.8; 33 0.75,-1.8; 34 0.75,1.8; 35 1.25,-1.8; 36 1.25,1.8; 37 1.75,-1.8; 38 1.75,1.8; 39 2.25,-1.8; 40 2.25,1.8; 41 2.75,-1.8; 42 2.75,1.8; 43 3.25,-1.8; 44 3.25,1.8; 45 3.75,-1.8; 46 3.75,1.8; 47 4.25,-1.8; 48 4.25,1.8; 49 4.75,-1.8; 50 4.75,1.8; 51 5.25,-1.8; 52 5.25,1.8; 53 5.75,-1.8; 54 5.75,1.8; 55 6.25,-1.8; 56 6.25,1.8; 57 6.75,-1.8; 58 6.75,1.8; 59 7.25,-1.8; 60 7.25,1.8 | smd 0.9 x 1.8: F1 -9,0; F2 9,0 | hole 0.6: -8.3,1.5; 8.3,1.5
FB0402 = smd 0.45 x 0.6: 1 -0.475,0; 2 0.475,0
FB1206 = smd 1.6 x 1.8: 1 -1.4,0; 2 1.4,0
1X02_2.54_SCREWTERM = drill 1.016 square: P1 2.54,0; P2 0,0
SOT-323 = smd 0.7 x 0.9: P$1 -0.65,-0.9; P$2 0.65,-0.9; P$3 0,1
SOT-23 = smd 1 x 1.4: P$1 -0.95,-1.1; P$2 0.95,-1.1; P$3 0,1
MLP8L33 = smd 0.42 x 0.7: 1 -0.975,-1.4; 2 -0.325,-1.4; 3 0.325,-1.4; 4 0.975,-1.4; 5 0.975,1.4; 6 0.325,1.4; 7 -0.325,1.4; 8 -0.975,1.4 | smd 2.37 x 1.7: F1 0,0.45
SOT223 = smd 1.219 x 2.235: 1 -2.311,-3.099; 2 0,-3.099; 3 2.311,-3.099 | smd 3.6 x 2.2: 4 0,3.099
R0402 = smd 0.45 x 0.6: 1 -0.475,0; 2 0.475,0
R0603 = smd 0.6 x 0.8: 1 -0.8,0; 2 0.8,0
R1206 = smd 1.6 x 1.8: 1 -1.4,0; 2 1.4,0
R0805 = smd 0.9 x 1.1: 1 -0.95,0; 2 0.95,0
SJ_2S-NO = smd 0.635 x 1.27: 1 -0.45,0; 2 0.45,0
SJ_2S = smd 0.635 x 1.27: 1 -0.412,0; 2 0.412,0
RASPBERRYPI-SHIELD-CONNECTOR = drill 1 square: 1 -15.24,-1.27 | drill 1 pad 1.676: 2 -15.24,1.27; 6 -10.16,1.27 | drill 1: 3 -12.7,-1.27; 4 -12.7,1.27; 5 -10.16,-1.27; 7 -7.62,-1.27; 8 -7.62,1.27; 9 -5.08,-1.27; 10 -5.08,1.27; 11 -2.54,-1.27; 12 -2.54,1.27; 13 0,-1.27; 14 0,1.27; 15 2.54,-1.27; 16 2.54,1.27; 17 5.08,-1.27; 18 5.08,1.27; 19 7.62,-1.27; 20 7.62,1.27; 21 10.16,-1.27; 22 10.16,1.27; 23 12.7,-1.27; 24 12.7,1.27; 25 15.24,-1.27; 26 15.24,1.27
DIPSWITCH-02-50MIL = smd 0.762 x 1.27: 1 -0.635,-3.7; 2 0.635,-3.7; 3 0.635,3.7; 4 -0.635,3.7
COILCRAFT-ETH1-230L = smd 1.27 x 2.032: 1 -6.35,8.001; 2 -3.81,8.001; 3 -1.27,8.001; 4 1.27,8.001; 5 3.81,8.001; 6 6.35,8.001; 9 6.35,-8.001; 10 3.81,-8.001; 11 1.27,-8.001; 12 -1.27,-8.001; 13 -3.81,-8.001; 14 -6.35,-8.001 | smd 2.032 x 1.27: 7 8.128,-1.27; 8 8.128,-3.81; 15 -8.128,-3.81; 16 -8.128,-1.27
WE_EP13_SMD_10PIN = smd 1.88 x 1.143: 1 -8.18,-4.96; 2 -8.18,-2.48; 3 -8.18,0; 4 -8.18,2.48; 5 -8.18,4.96; 6 8.18,4.96; 7 8.18,2.48; 8 8.18,0; 9 8.18,-2.48; 10 8.18,-4.96
TP_5021 = drill 1: P$1 0,0
TP_5000 = drill 1: P$1 0,0
SOIC-16-NARROW = smd 0.65 x 1.75: 1 -4.55,-2.8; 2 -3.25,-2.8; 3 -1.95,-2.8; 4 -0.65,-2.8; 5 0.65,-2.8; 6 1.95,-2.8; 7 3.25,-2.8; 8 4.55,-2.8; 9 4.55,2.8; 10 3.25,2.8; 11 1.95,2.8; 12 0.65,2.8; 13 -0.65,2.8; 14 -1.95,2.8; 15 -3.25,2.8; 16 -4.55,2.8
MSOP16(12) = smd 0.3 x 1.02: 1 -1.75,-2.4; 3 -0.75,-2.4; 5 0.25,-2.4; 6 0.75,-2.4; 7 1.25,-2.4; 8 1.75,-2.4; 9 1.75,2.4; 10 1.25,2.4; 11 0.75,2.4; 12 0.25,2.4; 14 -0.75,2.4; 16 -1.75,2.4
SO08-POWERPAD = smd 0.45 x 2.15: 1 -1.875,-2.875; 2 -0.625,-2.875; 3 0.625,-2.875; 4 1.875,-2.875; 5 1.875,2.875; 6 0.625,2.875; 7 -0.625,2.875; 8 -1.875,2.875 | smd 3.1 x 2.4: POWERPAD 0,0
TQFP44-0.8MM = smd 0.55 x 1.5: 1 -4,-5.7; 2 -3.2,-5.7; 3 -2.4,-5.7; 4 -1.6,-5.7; 5 -0.8,-5.7; 6 0,-5.7; 7 0.8,-5.7; 8 1.6,-5.7; 9 2.4,-5.7; 10 3.2,-5.7; 11 4,-5.7; 23 4,5.7; 24 3.2,5.7; 25 2.4,5.7; 26 1.6,5.7; 27 0.8,5.7; 28 0,5.7; 29 -0.8,5.7; 30 -1.6,5.7; 31 -2.4,5.7; 32 -3.2,5.7; 33 -4,5.7 | smd 1.5 x 0.55: 12 5.7,-4; 13 5.7,-3.2; 14 5.7,-2.4; 15 5.7,-1.6; 16 5.7,-0.8; 17 5.7,0; 18 5.7,0.8; 19 5.7,1.6; 20 5.7,2.4; 21 5.7,3.2; 22 5.7,4; 34 -5.7,4; 35 -5.7,3.2; 36 -5.7,2.4; 37 -5.7,1.6; 38 -5.7,0.8; 39 -5.7,0; 40 -5.7,-0.8; 41 -5.7,-1.6; 42 -5.7,-2.4; 43 -5.7,-3.2; 44 -5.7,-4
M2-1 = drill 2.1 pad 4.4: 1 0,0
MOLEX-85502-5008 = smd 0.76 x 6.35: 1 -4.445,10.3; 2 -3.175,10.3; 3 -1.905,10.3; 4 -0.635,10.3; 5 0.635,10.3; 6 1.905,10.3; 7 3.175,10.3; 8 4.445,10.3 | smd 5.15 x 2.8: S1 -8.1,0; S2 8.1,0
CRYSTAL-SMD-3225-GND = smd 1.4 x 1.2: 1 -1.1,-0.85; 2 1.1,-0.85; 3 1.1,0.85; 4 -1.1,0.85

### Placement (x,y rotation side)
C1  18.5,29.22 90 top
C2  13.6,28.7 270 top
C3  16.49,25.92 0 top
C4  12.2,28.3 180 top
C5  11,29.7 270 top
C6  10.9,32.9 90 top
C7  25.9,34.8 180 top
C8  25.5,39.6 0 top
C9  25.9,35.8 0 top
C10  54.7,41.5 0 top
C11  28.2,39.1 180 top
C12  27.8,37 90 top
C13  8.8,37.73 90 top
C14  9.15,35.58 180 top
C15  25.9,36.7 180 top
C16  33.8,33.4 180 top
C17  39.9,43 0 top
C18  39.9,42 0 top
C19  54.7,40 0 top
C20  30.2,23.8 0 top
C21  49.1,38.8 180 top
C22  48,45.2 0 top
C23  44.5,51 180 top
C24  70.7,20 0 top
C25  61.65,22.5 180 top
C26  65.4,18.7 0 top
C27  64.6,20.2 0 top
C28  30,12 180 top
C29  43.6,23.3 0 top
C30  47.56,23.4 0 top
C31  75.7,21.2 0 top
C32  43,6 180 top
C33  52.5,36.7 90 top
C34  60.2,20 180 top
C35  48,19.7 270 top
C36  53.8,27.9 0 top
C37  43.4,28.2 180 top
C38  39.9,27.6 0 top
C39  43.3,29.7 0 top
C40  37,9.5 180 top
C41  35.3,16 180 top
C42  45.7,20.9 0 top
C43  37.4,53.6 180 top
C44  37.4,51.3 180 top
C45  37.4,46.7 180 top
C46  37.4,49 180 top
C47  37.4,44.4 180 top
C48  30,4 180 top
C49  65,37.9 90 bottom
C50  63.1,37.9 90 bottom
D1  15.5,2 270 top
D2  21.5,2 270 top
D3  45,34.9 90 top
D4  45.85,42.61 180 top
D5  33.8,45.26 90 top
D6  70.25,46.5 270 top
D7  61.1,11.1 0 top
D8  60.1,15 0 top
D9  61.1,6.5 0 top
D10  59.8,2.4 0 top
D11  40.6,34 180 top
D12  54.7,21.7 180 top
D13  41.3,31.3 0 top
D14  54.2,11.1 0 top
D15  52.9,15 0 top
D16  54.2,6.5 0 top
D17  52.1,2.4 0 top
D18  36.7,18.8 180 top
D19  81,46.5 0 top
EXT1  7,22 90 top
FB1  11.05,27.11 90 top
FB2  60.5,18.1 180 top
FB3  53.3,18.3 180 top
FB4  38.7,13.1 90 top
FB5  34.5,7.5 180 top
J3  82.76,52.58 270 top
J4  38.5,2.25 180 top
OUTLINE1  0,0 0 top
Q1  13.11,25.07 90 top
Q2  20.26,24.73 90 top
Q3  53.42,32.24 0 top
Q4  75,50.5 180 top
R1  15.8,24.5 90 top
R2  17.18,23.52 180 top
R3  19,2 180 top
R4  13,2 0 top
R5  51.4,40.8 180 top
R6  21.4,31.1 90 top
R7  28.4,41.5 90 top
R8  25.9,38.4 180 top
R9  25.9,37.55 180 top
R10  46.1,38.6 0 top
R12  25.5,42 0 top
R13  25.5,41 0 top
R14  22.89,45.5 0 top
R15  45.1,45.2 180 top
R16  42.2,38 180 top
R17  31,43.5 180 top
R18  72.5,21.3 270 top
R19  65.8,21.8 180 top
R20  67.9,18.7 180 top
R21  67.1,20.2 180 top
R22  52.5,25 180 top
R23  40.9,9.4 180 top
R24  46.3,30.5 270 top
R25  39.3,36 270 top
R26  52.5,26.3 180 top
R27  54.7,36.7 270 top
R28  55.1,25.9 270 top
R29  44,8.2 180 top
R30  52.3,28.6 270 top
R31  42.7,26.9 0 top
R32  49.61,30.46 180 top
R33  40.3,29.6 0 top
R34  42.7,25.6 0 top
R35  41.5,21.6 180 top
R36  42.5,20.2 0 top
R37  2.42,23.54 90 top
R38  39.7,23.9 0 bottom
R39  2.42,20.15 90 top
SJ1  28.6,25.6 0 bottom
SJ2  31.7,25.6 180 bottom
SJ3  2,15.3 90 bottom
SV1  17.78,52.07 0 top
SW1  7.11,44.44 180 top
T1  64.55,32.5 0 top
T2  59.5,49 180 top
TP1  31,46.5 0 top
TP2  2,47 0 top
TP3  2,44 0 top
TP4  2,40.5 0 top
TP5  17.82,46.99 0 top
TP6  22.04,46.99 0 top
TP7  30.66,35.49 0 top
TP8  2,37.5 0 top
TP9  6,2 0 top
U2  33.92,38.82 90 top
U3  20.42,16.86 270 top
U4  47.55,26.95 90 top
U5  44,15 0 top
U6  17.25,38.75 0 top
U$3  [EH-LOGO]  46.4,2.2 0 top
X1  5.5,35.5 0 top
X2  5.5,8.5 0 top
X3  48.5,35.5 0 top
X4  48.5,8.5 0 top
X5  80,11.5 90 top
Y1  16,29 90 top

### Tracks (layer width: path | path; a pad name or v marks a point on that pad's centre or on a via)
3.3V  (1 unrouted)
5V  (via drill 0.25, 0.4)
  Top 0.3: EXT1.8 3.95,16.25 3.3,16.9 v2.7,16.9
  Top 0.4: C47.1 v39.5,44.4 | C45.1 v39.5,46.7 | C46.1 v39.5,49 | D4.C 42.61,42.61 42.6,42.6 | 42.6,42.6 v41.2,41.2 38.7,41.2 | U2.3 37.02,42.02 v37,42.3 | v35.3,41.2 37,41.2 37.1,41.3 | D5.C v33.8,42.6 | 38.7,41.2 37.1,41.2 | v39.6,53.6 C43.1 | C44.1 40,51.3 40.1,51.4 v40.1,52.4 | C23.+ 41.7,50.8 v41.7,49.6 | R15.2 43.2,45.2 42.6,44.6 42.6,42.6 | C18.1 38.7,42 | 38.7,42 38.7,41.2 | C17.1 38.9,43 38.7,42.8 38.7,42
  Route15 0.3: v2.5,28 2.8,28
  Route15 0.4: v33.2,25.6 33.2,37.3 33.8,37.9 33.8,41.2 | 33.8,41.2 v35.3,41.2 | 33.8,41.2 v33.8,42.6
  Bottom 0.3: v2.7,16.9 2.7,18 2.3,18.4 2.3,27.8 v2.5,28
  Bottom 0.4: SJ2.2 v33.2,25.6
  pour Route15: -1.9,58.2 -1.9,27.5 9.1,27.5 9.1,47.9 26.8,47.9 26.8,40.3 49.8,40.3 49.8,58.2
+3V3  (via drill 0.4)
  Top 0.15: C3.1 15.72,25.92 15.7,25.9 | R1.2 15.62,25.07 15.6,25.1 15.6,25.3 15.5,25.4 15.3,25.4 v15,25.7 | EXT1.6 3.35,15.75 v3.2,15.8
  Top 0.3: EXT1.48 4.15,26.25 v3.7,26.7
  Top 0.4: Q1.P$2 14.98,25.72 v15,25.7 15.22,25.92 C3.1 | U2.2 33.02,38.82 v32.7,38.8 32.78,38.82 U2.4 | R5.2 49.9,40.8 v49.6,40.5
  Top 0.8: C16.A 31.2,33.4 30.7,33.9 30.7,35.2 | 30.7,35.2 30.7,35.45 TP7.P$1 | U2.4 30.82,38.12 30.2,37.2 30.2,36.1 30.7,35.2 | 37,38.8 v35.2,38.8 v32.7,38.8 31.1,38.8
  Route15 0.3: v3.7,26.7 3.7,26.9
  Route15 0.4: v15,25.7 14.8,25.7 | v28.2,27 28.2,26.9 | v49.6,40.5 49.6,39.8 49.2,39.4 35.7,39.4 v35.2,38.8
  Bottom 0.15: v3.2,15.8 2.05,15.8 SJ3.2
  Bottom 0.4: SJ1.2 28.19,26.99 v28.2,27
  pour Route15: -1.9,27 -1.9,-2.3 28,-2.3 28,21.2 35.8,21.2 35.8,39.4 26.8,39.4 26.8,27
ENC-3V3  (via drill 0.25)
  Top 0.15: R14.2 v24.3,45.5 | v25.4,43.3 25.9,43.3 26.4,42.8 26.4,42.4 26.23,42.23 26.07,42.23 R12.2 26.18,41.8 26.3,41.8 26.4,41.7 26.4,41.3 26.3,41.2 26.1,41.2 25.98,41.08 R13.2 | U6.15 24.15,37.15 v24.3,37.2 24.5,37 24.5,36.9 24.8,36.6 24.8,36.2 25,36 25.3,36 25.43,35.88 C9.1 | U6.12 24.05,34.75 v24.3,34.5 24.6,34.6 25.4,34.6 25.43,34.62 C7.2 | U6.4 15.65,32.05 v16,31.7 | v11,28.3 11,27.63 FB1.2 | U6.44 10.55,34.75 10.4,34.6 v10.4,34.1 10.5,34.1 10.8,33.7 10.8,33.38 C6.2 | C4.2 v11,28.3 | C5.2 v11,28.3 | U6.18 23,39.6 v24.3,39.6 C8.1
  pour Route15: 9.9,27.7 9.9,47.2 26.1,47.2 26.1,27.5
ETH_INT  (via drill 0.25)
  Top 0.15: v13.6,35.1 20.45,41.95 U6.24 20.45,45.35 20.8,45.7 22,45.7 | v3.3,21.7 3,21.7 2.9,21.58 R39.2 | R14.1 22.41,45.59 22.3,45.7 22,45.7 | 22,45.7 22,46.6 21.9,46.7 21.9,46.85 TP6.P$1
  Bottom 0.15: v13.6,35.1 13.6,32.7 11.8,30.9 11.8,26.8 10.6,25.6 3.8,25.6 3,24.8 3,22 v3.3,21.7
ETH_MISO  (via drill 0.25)
  Top 0.15: v13.1,42 11.6,42 U6.35 | EXT1.56 6.35,28.25 v6.4,28.2 | TP5.P$1 17.82,47.32 19.8,49.3 26.44,49.3 SV1.21
  Bottom 0.15: TP5.P$1 12.39,46.99 11.7,46.3 11.7,43.4 v13.1,42 13,41.9 13,32.7 10.9,30.6 10.9,29.1 10,28.2 v6.4,28.2
ETH_MOSI  (via drill 0.4)
  Top 0.15: EXT1.58 3.35,28.75 1.4,30.7 1.4,35.1 3.2,36.8 3.2,39.8 | 3.2,39.8 2.1,40.5 TP4.P$1 | 3.2,39.8 8.3,39.8 9.6,41.1 11.5,41.1 U6.36 11.6,41.2 v14.2,41.2
  Bottom 0.15: SV1.19 23,48.4 21.2,48.4 20.2,47.4 20.2,45.8 17.1,42.7 15.7,42.7 v14.2,41.2
ETH_MUX  (via drill 0.25)
  Top 0.15: EXT1.42 6.35,24.75 v6.5,24.9 | v16.4,21.4 U3.1 18.31,21.61 18.71,21.61 20.5,23.4 21.74,23.4 Q2.P$1 25.38,23.78 27.1,25.5 28.7,25.5 v30.2,27 | R7.2 28.4,42.6 v28.95,43.15 29.3,43.5 R17.2 30.52,46.02 TP1.P$1
  Bottom 0.15: v6.5,24.9 12.9,24.9 v16.4,21.4 | v30.2,27 30.2,32.9 29.5,33.6 29.5,42.6 v28.95,43.15
ETH_SCK  (via drill 0.25, 0.4)
  Top 0.15: TP3.P$1 2,42.7 0.9,41.6 0.9,30.6 3.7,27.8 5.15,27.8 EXT1.54 | v3.7,39.2 3.9,39.4 8.45,39.4 9.4,40.35 U6.37 16.35,40.35 v18.7,42.7
  Bottom 0.15: v3.7,39.2 3.7,42.3 TP3.P$1 | v18.7,42.7 22.7,42.7 30.3,50.3 30.3,50.62 SV1.23
ETH_SS  (via drill 0.25)
  Top 0.15: U6.34 8.45,42.75 7.7,42 | 7.7,42 7.7,40.78 SW1.4 | SW1.3 6.47,41.98 6.5,42 | 6.5,42 7.7,42 | TP2.P$1 2.3,46.5 6.5,42 | R37.2 2.42,26.68 v1.3,27.8
  Bottom 0.15: v1.3,27.8 1.3,36.3 0.9,36.7 0.9,45.9 TP2.P$1
GNDA  (via drill 0.25, 0.4)
  Top 0.15: v56.8,40.4 56.8,40.7
  Top 0.4: T2.10 49.64,53.96 v49.6,54
  Route2 0.4: v49.6,54 49.2,54 49.1,53.9
  Route2 1: v64,37.4 61.8,37.4 59.1,40.1 57.2,40.1 v56.8,40.4
  Bottom 0.15: C49.1 C50.1 63.98,37.42 v64,37.4
  other vias: 49.8,52.4 47.8,49.6 47.8,52.4 50.2,50.4 33.8,47.9 35.2,49 35.3,46.7 35.3,44.4 35.2,51.3 35.3,53.7 13.2,45.9 14.2,45.9 15.2,45.9 16.2,45.9 18.9,45.9 10.1,39.5 10,38 10,37.1 9.2,39.3 8.7,34.7 13.4,31.6 13.6,27.3 15,26.6 18.2,30.5 17.1,31.6 13.2,30.4 19.3,29.6 23.8,32.2 21.4,29.9 22.5,28.5 18.8,31.6 24.4,35.3 24.2,36.3 28.6,35.9 24.3,40.4 28.4,38.2 27.2,41.2 27.1,42.3 27.1,43.3 12.7,29.3 12.7,27.3 17.8,25.9 17,26.75 17,25.05 18.8,27.75 22.7,25.7 21.4,26.8 24.8,20.1 21.6,20.2 16.1,12.4 17.6,11.4 19.1,12.3 29,13.6 27.2,13.3 27.1,11.7 27.7,10.5 29.1,10.4 29,2.4 27.6,2.5 27,3.5 27.4,5.7 29.1,5.6 22.3,3.2 23.8,1.4 16.7,3.3 17.7,1.1 13.6,3.2 10.7,1.3 1.3,1.2 1.3,5.4 8.3,6.8 25.1,6.8 17.2,8.9 9.4,13 1.8,12.9 1.7,17.5 6.8,16.9 6.9,15.5 3.9,13.3 3.7,17.5 3.7,19.9 1.5,20.2 6.8,21.4 1.3,25.4 3.2,25.9 1.9,28.7 6.8,27.4 6.8,26.1 6.45,28.95 3.15,30.45 3.75,32.75 1.15,26.55 8.85,31.25 11.75,32.45 10.95,31.65 14.55,34.65 13.75,36.75 13.85,38.55 14.15,42.85 5.35,40.75 2.15,45.45 3.95,48.75 1.25,54.75 11.35,54.85 17.55,48.75 9.55,48.25 10.75,44.65 22.85,43.85 24.55,47.05 27.45,48.85 49.75,41.55 46.65,44.05 45.75,40.85 42.65,40.85 41.15,42.25 41.25,43.45 35.65,29.95 35.25,34.95 35.25,31.85 36.65,24.85 35.55,22.45 32.05,21.75 29.15,21.65 31.55,23.85 30.65,22.85 25.95,23.25 23.65,11.35 20.85,34.85 20.85,36.95 17.85,34.85 21.25,41.85 18.75,41.45 16.85,42.05 17.75,28.95 2.15,34.75 6.15,32.45 32.4,43.5 30.4,41.6 26.4,33.9 23,33.8 25.9,28.8 28.4,40.2 53.35,41.45 53.35,40.15 58.25,43.15 58.05,55.15
  pour Top: -2.6,-2.6 -2.6,59.2 58.7,59.2 58.7,39.8 37.1,39.8 37.1,20.8 29.5,20.8 29.5,-2.6
  pour Route2: -2.6,-2.6 -2.6,59.2 58.7,59.2 58.7,39.8 37.1,39.8 37.1,20.8 29.5,20.8 29.5,-2.6
  pour Bottom: -2.6,-2.6 -2.6,59.2 58.7,59.2 58.7,39.8 37.1,39.8 37.1,20.8 29.5,20.8 29.5,-2.6
N$1  (via drill 0.4)
  Top 0.4: T1.10 68.36,22.99 v68.45,22.9 | v73.3,8.3 69.72,8.3 X5.2
  Bottom 0.4: v68.45,22.9 69.3,22.9 72.8,19.4 72.8,8.8 v73.3,8.3
N$2  (via drill 0.4)
  Top 0.4: X5.1 74.05,7.05 v74.75,7.05 | v70.35,26.2 70.4,26.2 70.5,26.1 70.5,25.1 70.6,25 70.95,24.85 T1.9
  Bottom 0.4: v74.75,7.05 75.1,7.4 75.1,20.8 70.5,25.4 70.5,26.1 70.4,26.2 v70.35,26.2
N$3  (via drill 0.4)
  Top 0.4: X5.3 73.69,9.6 v73.9,9.8 | v61.15,26.1 61.15,25.25 61,25.1 T1.13
  Bottom 0.4: v73.9,9.8 73.9,20 68.5,25.4 61.85,25.4 v61.15,26.1
N$4  (via drill 0.4)
  Top 0.4: X5.6 v66,13.41 v66,13.4 | v59.25,23.1 58.15,24.45 T1.14
  Bottom 0.4: v66,13.4 67,14.4 67,19.4 63.3,23.1 v59.25,23.1
N$5
  Top 0.15: C31.1 74.1,21.6 73.6,22.1 R18.1 71.4,22.1 70.7,21.4 70.7,19.2 70.2,18.7 R20.1 68.5,18.9 68.5,19.7 68.3,19.9 68,19.9 67.9,20 R21.1 67.9,20.5 67.5,20.5 67.3,20.7 67.3,21.6 67.1,21.8 R19.1
N$6  (via drill 0.4)
  Top 0.4: 63.2,16.1 63.2,17.3 63,17.5 62.4,17.5 61.9,18 FB2.1 62.5,18.4 62.5,19.5 62.2,19.8 61.2,19.8 C34.1 | 63.2,16.1 62.4,15.3 62.4,15.15 D8.C | D10.C v63.8,2.4 | v65.3,5.8 63.95,5.8 D9.C | D7.C v61.6,11.1 | v63.8,16.1 63.2,16.1
  Bottom 0.4: v63.8,2.4 63.8,4.3 v65.3,5.8 61.6,9.5 v61.6,11.1 61.6,13.9 v63.8,16.1
N$7
  Top 0.15: U4.12 43.6,27.2 43.5,27.1 R31.2
N$8
  Top 0.4: D17.A 49.95,2.75 50.6,3.4 51.6,3.4 51.9,3.7 51.9,6.35 D16.A D14.A 51.4,11.1 51.1,11.4 51.1,14.65 D15.A 50.75,15.35 51.4,16 52.4,16 FB3.1 56.4,20 C34.2
N$9  (via drill 0.25)
  Top 0.15: U5.7 43.38,19.27 v43.4,19.3 | v38.7,31.3 D13.C 38.76,31.34 v38.7,31.3 | v38.7,31.3 38.6,31.3 38.6,34 | 38.6,34 D11.2 | 38.6,34 38.6,34.3 39,34.7 39,35.2 R25.2 | Q4.1 77.31,52.11 v77.3,51.9 | v69.15,38.5 v69.15,34.5
  Bottom 0.15: v43.4,19.3 43.4,20.3 42,21.7 40.5,21.7 39.4,22.8 39.4,23.75 R38.2 39.25,30.75 v38.7,31.3 40.1,32.7 58.4,32.7 60.2,34.5 v69.15,34.5 | v77.3,51.9 77.3,50.6 73.5,46.9 73.5,43.25 69.15,38.9 v69.15,38.5
N$10
  Top 0.4: Q4.4 75,50.9 | 75,50.9 Q4.2 | J3.P2 80.58,52.58 78.8,50.8 75.1,50.8 75,50.9
N$11  (via drill 0.25)
  Top 0.15: T1.6 70.9,34.45 69.95,33.5 v69.95,32.3 | v26,14.5 26,14.9 24.9,16 23.8,16 23.5,16.3 23.31,16.3 U3.12
  Bottom 0.15: v69.95,32.3 69.95,31.9 66.75,28.7 60.4,28.7 46.1,14.3 26.1,14.4 v26,14.5
N$12  (via drill 0.25)
  Top 0.15: U3.9 v25.29,12.31 v25.3,12.3 | v68.15,29 68.15,39.9 68.45,40.2 68.45,40.5 68.55,40.6 68.46,40.6 T1.5
  Bottom 0.15: v25.3,12.3 30.5,12.3 30.7,12.5 30.7,13.7 30.9,13.9 46.4,13.9 60.7,28.2 67.35,28.2 v68.15,29
N$13  (via drill 0.25)
  Top 0.15: U3.7 20.11,13.61 v20.5,14 | v61.55,29.3 61.55,37.95 60.65,38.85 60.65,40.41 T1.2
  Bottom 0.15: v20.5,14 24.2,14 25.4,15.2 46.3,15.2 60.4,29.3 v61.55,29.3
N$14  (via drill 0.25)
  Top 0.15: U3.4 20.09,17.51 v20.7,16.9 | v60.5,29.9 60.1,30.3 60.1,38.1 59.2,39 58.85,39 58.75,39.1 58.75,39.7 58.2,40.1 T1.1
  Bottom 0.15: v20.7,16.9 24.2,16.9 25.5,15.6 46,15.6 60.3,29.9 v60.5,29.9
N$15
  Top 0.4: C33.2 52.55,37.65 52.8,37.9 52.8,38.3 53,38.5 54.3,38.5 54.5,38.3 54.5,37.85 R27.1
N$16
  Top 0.4: C22.1 R15.1
N$17  (via drill 0.25)
  Top 0.15: R22.1 52.7,25 52.5,25.2 52.5,26.2 52.4,26.3 R26.2 51.6,26.2 U4.3 v48.1,26.2 | D11.1 42.6,34 42.8,33.8 42.8,33.3 44.1,32 v44.1,31.8
  Bottom 0.15: v44.1,31.8 44.1,31 45.1,30 45.1,28.7 47.5,26.3 47.9,26.3 v48.1,26.2
N$18
  Top 0.15: R23.1 41.8,9.6 41.9,9.7 42.2,9.7 43.38,10.88 U5.2
N$19
  Top 0.4: U5.3 44.62,10.57 44.6,10.5 43.05,8.95 R29.2
N$20  (via drill 0.25)
  Top 0.15: U4.10 C37.1 43.67,28.4 43.67,28.65 43.6,28.75 v43.5,28.9
  Bottom 0.15: R38.1 41.15,23.9 43.2,25.9 43.2,28.6 v43.5,28.9
N$21
  Top 0.4: D19.C 83.15,47.35 83.1,47.4 81.6,47.4 81.4,47.6 81.4,48.68 J3.P1
  Bottom 0.8: X3.1 47.5,35.5 48,36 69.25,36 70.35,37.1 70.35,37.7 72.75,40.1 81.3,40.1 83,41.7 83,49.8 J3.P1
N$22
  Top 0.15: U4.11 44.4,27.7 44.3,27.6 42.3,27.6 41.9,28 41.9,29.6 | 41.9,29.6 42.8,29.6 42.8,29.73 C39.1 | R33.2 41.9,29.6
N$23
  Top 0.15: C38.1 39.1,27.6 38.9,27.8 38.9,29.3 39,29.4 39.3,29.4 R33.1
N$24
  Top 0.15: R28.2 55.1,25.6 54.9,25.8 54.7,25.8 54.4,26.1 54.4,26.7 54,27.1 51.5,27.1 50.9,27.7 U4.6
N$25
  Top 0.15: Q3.4 54.4,30.2 55.1,29.5 R28.1
N$26
  Top 0.15: C36.1 53.33,27.8 R30.2 51.5,27.8 51.1,28.2 U4.7
N$27
  Top 0.4: Q3.1 52.45,30.3 | 52.45,30.3 52.45,30.1 | 52.45,30.1 52.45,29.55 R30.1 | Q3.3 53.74,30.24 53.6,30.1 53.1,30.1 | 53.1,30.1 52.45,30.1 | Q3.2 53.09,30.1 53.1,30.1 | R32.1 50.56,30.44 50.8,30.2 52.34,30.2 52.45,30.3
N$28  (via drill 0.4)
  Top 0.2: 46.4,31.4 R24.1 46.3,32.3
  Top 0.4: 52.4,32.3 52.45,32.85 Q3.8 52.45,35.7 C33.1 | Q3.7 53.09,32.8 53.1,32.8 | Q3.6 53.74,32.9 | 53.74,32.9 53.74,32.8 53.74,32.74 53.7,32.7 Q3.F1 | Q3.5 54.4,32.91 54.4,32.9 53.74,32.9 | 45,33.1 D3.1
  Top 0.8: Q3.F1 53.31,32.8 53.1,32.8 52.4,32.3 46.3,32.3 45.8,32.3 45,33.1 | T2.5 68,44.2 68.01,44.19 68.74,44.19 v69.1,44.3 | v58.4,37.7 58.4,33.9 57.3,32.8 53.74,32.8
  Bottom 0.8: v69.1,44.3 65.4,44.3 60.9,39.8 60.9,38.5 60.1,37.7 v58.4,37.7
N$29
  Top 0.4: D6.1 70.25,50.85 69.6,51.5 67.7,51.5 T2.2
N$30
  cutout Route15: 64.7,3.7 64.7,0.2 77.3,0.2 77.3,3.7
  cutout Route2: 64.7,3.7 64.7,0.2 77.3,0.2 77.3,3.7
  cutout Bottom: 64.7,3.7 64.7,0.2 77.3,0.2 77.3,3.7
  cutout Top: 64.7,3.7 64.7,0.2 77.3,0.2 77.3,3.7
N$31
  Top 0.2: U4.16 46.1,25.2 46.4,25.5 46.4,29.6 R24.2
N$32
  Top 0.15: U4.14 45.1,26.2 45.05,26.15 44.5,26.15 44.25,25.9 43.7,25.9 43.6,25.8 43.6,25.7 R34.2
N$33
  Top 0.4: D3.2 45,37 44.7,37.3 43.7,37.3 43.3,37.7 R16.1 44,38.7 45.2,38.7 45.3,38.8 R10.1
N$34
  Top 0.15: 48.15,38.9 C21.2
  Top 0.4: R10.2 47,38.7 48,38.7 48.15,38.9
N$36
  Top 0.3: D1.A R4.2
N$37  (via drill 0.25)
  Top 0.15: C1.1 18.3,28.74 18.3,28.3 v17.9,27.9 Y1.1 | U6.2 14.05,31.85 v14.2,31.6
  Bottom 0.15: v14.2,31.6 v17.9,27.9
N$38
  Top 0.3: D2.A R3.1
N$39
  Top 0.15: R8.2 25.43,38.48 25.3,38.6 24.9,38.6 | 24.9,38.6 23.1,38.6 U6.17 | C11.2 27.73,38.92 27.7,38.9 27.6,39 25,39 24.9,38.9 24.9,38.6
N$40  (via drill 0.25)
  Top 0.15: R5.1 55.7,40.8 | 55.7,40.8 55.7,41.5 | 55.7,41.5 C10.2 | C19.2 55.7,40 | 55.7,40 55.7,40.8 | 55.7,41.5 55.7,41.9 56.1,42.3 65.4,42.3 65.82,41.88 T1.4 65.8,40.48 65.8,40.2 65.3,39.8 65.3,39.3 v65,39 | 55.7,40 55.9,40 56.1,40.2 56.1,41.1 56.9,41.9 62.6,41.9 62.8,41.7 62.8,41.3 63.28,40.82 T1.3 63.1,40.32 v63.1,39
  Bottom 0.15: C50.2 v63.1,39 | C49.2 v65,39
N$41  (via drill 0.25)
  Top 0.15: U6.9 19.65,31.75 v19.6,31.7 | v11.7,2 R4.1
  Bottom 0.15: v19.6,31.7 19.6,31.2 19.9,30.9 19.9,26.4 17.3,23.8 17.3,18.5 12.5,13.7 12.5,2.8 v11.7,2
N$42  (via drill 0.25)
  Top 0.15: R3.2 v17.8,2 | v20.4,31.6 20.4,33 U6.10
  Bottom 0.15: v17.8,2 16.9,2 13,5.9 13,13.6 17.7,18.3 17.7,23.6 20.4,26.3 v20.4,31.6
N$44
  Top 0.15: R8.1 26.38,38.23 26.4,38.2 26.7,38.2 26.8,38.1 26.8,37.9 | 26.8,37.9 26.8,37.8 26.7,37.7 26.52,37.7 R9.1 | C12.2 27.73,37.48 27.6,37.6 27.6,37.8 27.5,37.9 26.8,37.9
N$45
  Top 0.15: U6.11 21.25,31.73 R6.2
N$47
  Top 0.15: U6.3 14.85,30.4 Y1.3 14.1,30.1 13.8,29.8 13.8,29.38 C2.1
N$48
  Top 0.15: C27.2 R21.2
N$50
  Top 0.15: C24.2 71.6,19.9 72,19.9 72.2,20.1 72.2,20.3 R18.2
N$51
  Top 0.15: C25.2 60.65,22.2 60.45,22.2 60.35,22.1 60.35,21.9 60.85,21.4 63.7,21.4 64.1,21.8 R19.2
N$52
  Top 0.15: C26.2 R20.2
N$53
  Top 0.4: J4.P2 38.5,9.5 | 38.5,9.5 38.5,11.5 38.8,11.8 38.6,11.7 FB4.1 | C40.1 38.5,9.5
N$54
  Top 0.15: U5.5 45.88,19.32 45.3,19.9 43.4,19.9 43.3,20 R36.2 43.3,20.3 43.5,20.5 43.8,20.5 43.9,20.6 | C42.1 44.9,20.7 44.8,20.6 43.9,20.6 | R35.1 43.3,21.6 43.9,21 43.9,20.6
N$55
  Top 0.4: J4.P1 35.96,7.3 | 35.96,7.3 35.96,7.44 FB5.1 | C40.2 35.6,9.5 35.5,9.4 35.5,7.76 35.96,7.3
N$56
  Top 0.15: Q2.P$3 19.13,24.73 18.8,24.4 18.4,24.4 18.2,24.2 18.2,23.9 18,23.7 17.84,23.7 R2.1
N$57
  Top 0.15: R2.2 15.8,23.52 | 15.8,23.52 15.28,23.52 14.6,24.2 14.23,24.2 Q1.P$1 | R1.1 15.8,23.52
N$59
  Top 0.15: U6.16 24.45,37.95 24.7,37.7 24.9,37.7 | 24.9,37.7 25.27,37.7 R9.2 | C15.2 25.43,36.88 25.4,36.9 25,36.9 24.9,37 24.9,37.7
N$60
  Top 0.15: Q1.P$3 12.01,24.99 11.8,25.2 11.4,25.2 11.1,25.5 11.1,26.59 FB1.1
N$72  (via drill 0.25)
  Top 0.15: SV1.3 5.08,46.32 6.4,45 v9,45 | v10.1,29.5 10.1,29 9.85,28.75 EXT1.57
  Bottom 0.15: v9,45 9,44.7 8.5,44.2 8.5,36.6 9.6,35.5 9.6,30 v10.1,29.5
N$73  (via drill 0.25)
  Top 0.15: EXT1.59 8.3,29.3 7.85,29.3 7.6,29.55 v7.6,29.9
  Bottom 0.15: v7.6,29.9 7.6,33.7 8.1,34.2 8.1,50.32 SV1.5
N$74  (via drill 0.25)
  Top 0.15: SW1.2 6.47,49.17 v6.5,49.2
  Bottom 0.15: v6.5,49.2 6.4,49.3 6.4,51.6 6.8,52 9,52 9.1,52.1 31.78,52.1 SV1.26
N$76
  Top 0.15: R35.2 40.1,21.6 39.65,21.15 39.65,19.75 38,19.8 D18.A 38.7,18.8
  Top 0.2: C41.1 38.7,16 | 38.7,16 FB4.2 | 38.7,18.8 38.7,16
POE_A+  (via drill 0.4)
  Top 0.4: D14.C D7.A 58.95,11.35 59.7,12.1 60.3,12.1 60.6,12.4 v60.6,12.8 | T1.11 65.82,24.23 66.2,23.7 v66.2,23 | v69.1,20 C24.1
  Route15 0.4: v60.6,12.8 63.3,12.8 65.4,14.9 67.2,14.9 69.2,16.9 69.2,19.9 v69.1,20
  Bottom 0.4: v66.2,23 68.2,20.9 v69.1,20
POE_A-  (via drill 0.4)
  Top 0.4: D15.C D8.A v59.6,15 | 62.35,22.5 C25.1 63.05,22.5 63.35,22.8 63.35,23.6 63.28,24.13 T1.12 63.45,24.67 v63.45,27.2
  Bottom 0.4: v59.6,15 59.6,19.4 57.9,21.1 57.9,24.3 60.8,27.2 v63.45,27.2
POE_B+
  Top 0.4: D17.C D10.A 57.65,2.65 58.4,3.4 59,3.4 60,4.4 74.5,4.4 76,5.9 76,10.2 75.1,11.1 73.7,11.1 | 73.7,11.1 73.7,11.8 73.36,12.14 X5.5 65.47,12.14 64.6,13 64.6,17 63.5,18.1 63.5,19 63.2,19.3 63.2,19.7 63.5,20 63.6,20 C27.1 | 73.7,11.1 73.4,10.8 69.77,10.8 X5.4
POE_B-  (via drill 0.4)
  Top 0.4: D16.C D9.A 58.95,6.85 59.5,7.4 60.4,7.4 61.5,8.5 64.7,8.5 v64.8,8.6 | X5.8 66.05,15.95 | 66.05,15.95 66,15.9 | 66,15.9 66,14.9 66.2,14.7 69.3,14.7 69.4,14.8 69.58,14.8 X5.7 | v66,16.7 66,15.9 | 66.05,15.95 66,15.95 66,16.6 65.95,16.64 65.95,17.35 65.3,18 65.3,18.6 65.2,18.7 C26.1
  Bottom 0.4: v64.8,8.6 64.8,14.5 66,15.7 v66,16.7
RTN  (via drill 0.25, 0.4)
  other vias: 55.6,34.6 44.9,31.3 47.6,30.5 65.9,54.1 73.1,51.6 32.9,4 31.6,7.6 32.8,11.9 40.6,20.5 49.6,23.4 46.3,22 44.5,29.7 54,29.1 42.4,29 70.2,55 70.2,52.5 83.6,54.8 78.9,52.8 80.4,50.1 81.2,42.9 77,41.9 72.7,45.4 70.05,29.8 73.15,24.6 65.05,32.8 59.25,32.3 56.95,38 69.95,27.4 64.75,26.8 54.1,20.1 50.7,16.9 48.7,14.7 49.9,12.7 41.1,17 40.7,12.1 36.9,10.4 41.4,8.1 46.1,6 44.5,3.8 40.8,1.5 31.9,1.4 33.2,9.2 37.2,4.2 55.9,4.3 63.9,1.3 83.7,1.4 83.6,8 77,4.7 83.8,12.2 82.9,17.1 77.2,16.5 83.4,21.7 73.05,34.9 73.45,38.9 62.25,39 58.1,29.9 47.6,28.4 44,36.2 40.6,35.9 76.4,19.4 69.1,21.6 64.9,22.9 70.4,17.8 67.9,17.8 62.7,20.3 67.1,23.7 64.65,17.85 56.5,16.9 60.5,16.9 56.8,13.1 57.8,8.8 50,5 55.9,0.9 68.5,5.4 74.3,8.7 74.7,6.1 73,5.3 76.6,11.5 54.1,25.5 45.5,24.5 44.25,26.65 42,30.2 38.5,30 40.1,28.7 41,26.9 41,25.6 46.8,17.7 83.4,40 60,21 60.3,43 60.3,55 61,36.85
  pour Top: 59.6,59.2 59.65,39 38,39 38,19.9 30.5,19.9 30.5,-2.2 88,-2.2 88,59.2
  pour Bottom: 59.6,59.2 59.65,39 38,39 38,19.9 30.5,19.9 30.5,-2.2 88,-2.2 88,59.2
  pour Route2: 59.6,59.2 59.65,39 38,39 38,19.9 30.5,19.9 30.5,-2.2 88,-2.2 88,59.2
RX+  (via drill 0.25)
  Top 0.15: EXT1.38 6.55,23.75 v6.6,23.7 | v14.4,20.5 14.4,17.2 15.4,16.2 17.3,16.2 17.4,16.3 17.53,16.3 U3.5
  Bottom 0.15: v6.6,23.7 11.2,23.7 v14.4,20.5
RX-  (via drill 0.25)
  Top 0.15: U3.2 16.39,20.11 v16.2,20.3 | v3.9,24.3 5.15,24.3 EXT1.40
  Bottom 0.15: v16.2,20.3 16,20.3 12,24.3 v3.9,24.3
SGND
  Top 0.4: C31.2 79.2,21.2 79.9,20.5 79.9,19.7 X5.S2
  Top 0.8: X5.S2 80,3.7 79.8,3.5 79.8,3.4 80.2,3 80.2,3.2 X5.S1
SS2  (via drill 0.25)
  Top 0.15: EXT1.60 4.15,29.25 v3.9,29.5 | v7.5,47 7.5,48.09 SW1.1 7.75,48.34 8,48.6 8,48.9 8.8,49.7 8.8,51.4 9.5,52.1 29.24,52.1 SV1.24
  Bottom 0.15: v3.9,29.5 3.9,31.3 2.8,32.4 2.8,36.7 4.6,38.5 7,38.5 7.5,39 v7.5,47
TPIN+  (via drill 0.25)
  Top 0.15: C15.1 26.8,36.7 27,36.5 27,28.6 v23.4,25 | v19.2,14.9 U3.6
  Bottom 0.15: v23.4,25 23.4,24 19.4,20 19.4,15.1 v19.2,14.9
TPIN-  (via drill 0.25)
  Top 0.15: C11.1 28.8,38.9 29,38.9 29.1,38.8 29.1,29.2 v24.9,25 | v24.9,22.6 20.9,22.6 19.2,20.9 19.2,19.3 18.9,19 17.81,19 U3.3
  Bottom 0.15: v24.9,25 v24.9,22.6
TPOUT+  (via drill 0.25)
  Top 0.15: U6.20 v24.3,41.15 24.95,41.15 | 24.95,41.15 25.02,41.15 R13.1 25.02,41.08 24.95,41.15 | 24.9,41.2 24.95,41.15 | v26,17.5 U3.13
  Bottom 0.15: v24.3,41.15 25.25,41.15 26.9,39.5 26.9,18.4 v26,17.5
TPOUT-  (via drill 0.25)
  Top 0.15: U6.21 v24.4,41.95 | v24.4,41.95 25.02,41.95 R12.1 24.98,41.95 v24.4,41.95 | U3.10 26.31,13.61 27.3,14.6 27.3,17 v27.5,17.2
  Bottom 0.15: v27.5,17.2 27.4,17.2 27.3,17.3 27.3,39.73 R12.1 24.45,42 v24.4,41.95
TX+  (via drill 0.25)
  Top 0.15: R39.1 2.52,19.3 2.8,19.3 2.8,19.9 3.9,21 3.9,22.5 4.15,22.75 EXT1.34 6.35,22.75 v6.6,22.5 | v15.2,18.2 21.1,18.2 21.7,18.8 U3.14
  Bottom 0.15: v6.6,22.5 9.9,22.5 13.2,19.2 14.2,19.2 v15.2,18.2
TX-  (via drill 0.25)
  Top 0.15: U3.11 21.69,14.91 21,15.6 15.2,15.6 13.5,17.3 13.5,20.4 v13.4,20.5 | EXT1.36 5.15,23.3 v3.9,23.3 3.1,23.3 2.9,23.1 2.9,22.7 2.61,22.69 R37.1
  Bottom 0.15: v13.4,20.5 10.8,23.1 4.1,23.1 v3.9,23.3
U3_VCC  (via drill 0.25)
  Top 0.4: U3.16 26.61,21.41 29,23.8 | 29,23.8 C20.1 | v29,24.4 29,23.8
  Bottom 0.15: SJ1.1 29.01,25.31 29,25.3
  Bottom 0.4: 29,25.3 v29,24.4 | SJ2.1 SJ1.1
U4_INTVCC  (via drill 0.25)
  Top 0.15: C30.1 46.9,23.8 47.2,23.8 47.3,23.9 47.3,26.9 47.6,27.2 U4.5 50.8,27.2 50.9,27.1 v50.9,26.9 | v66.25,30.9 v66.25,38.1 | v70.35,44.4 70.35,45.35 D6.2
  Bottom 0.15: v50.9,26.9 56.3,26.9 60.3,30.9 v66.25,30.9 | v66.25,38.1 66.25,38.15 68.9,40.8 68.9,42.7 70.3,44.1 v70.35,44.4
UNREG_5V+
  Top 0.4: 48.8,44 C22.2 48.7,45.3 48.7,45.4 49.82,46.52 T2.7 | 48.8,44 48.8,43.41 D4.A | T2.6 48.84,44.04 48.8,44
VCAP
  Top 0.15: C14.1 10.2,35.58 | 10.2,35.58 11.52,35.58 U6.43 | C13.1 8.97,36.93 9.1,36.8 9.1,36.5 9.2,36.4 10,36.4 10.2,36.2 10.2,35.58
VCC(IO)  (via drill 0.4)
  Top 0.15: v3.2,14.8 5.15,14.8 EXT1.2
  Bottom 0.15: SJ3.1 3.15,14.85 v3.2,14.8
VDD  (via drill 0.4)
  Top 0.4: D12.1 v59,21.7 | FB2.2 57.8,18.1 v57.7,18 | R22.2 v50.9,25 50.7,25.2 U4.1 | C29.1 41.7,23.3 v41.6,23.2 | v47.8,21.7 47.8,20.85 C35.1 | v32.7,18.4 34.15,18.4 D18.C | R23.2 v39.3,9.4 | C32.A 40.2,6 v40.1,6.1 | U5.1 42.12,10.93 41.9,10.7 v41.5,10.7 | D19.A 78.85,46.35 78.3,45.8 77.2,45.8 v77,45.6 | T2.3 v69.3,49 | R25.1 v39.3,38 R16.2 | C21.1 50.2,38.5 v51.2,38.5
  Route15 0.4: v59,21.7 59.2,21.8
  pour Route15: 28.7,-2.4 28.7,20.5 36.5,20.5 36.5,39.7 50.5,39.6 50.5,58.2 85.9,58.2 85.9,-2.4
VSS
  Top 0.4: R29.1 44.95,9.15 45.7,9.9 45.88,10.12 U5.4 45.88,13.52 | C35.2 48,17.9 48.7,17.2
  Top 1: D12.2 52.3,21.8 52.5,21.3 50.6,21.3 50.1,20.7 50.1,18.2 | 51.8,18.2 51.9,18 FB3.2 51.8,18.2 | 51.8,18.2 50.1,18.2 | 50.1,18.2 49.7,18.2 48.7,17.2 47.2,15.7 44.9,15.7 44.3,15.1 | 44.3,15.1 44.1,15.1 U5.POWERPAD | 45.88,13.52 44.3,15.1

### Text on the board
Top: 1
Route2: 2
Route15: 3
Bottom: 4
tSilk: + | + | ELL-i.org | "PoElli-at" / PoE shield proto
bSilk: https://github.com/Ell-i/ELL-i-Eagle-Boards